# EAGLE board PowerSTEP01x4_002 (EAGLE 9.5.0), part 1 of 2
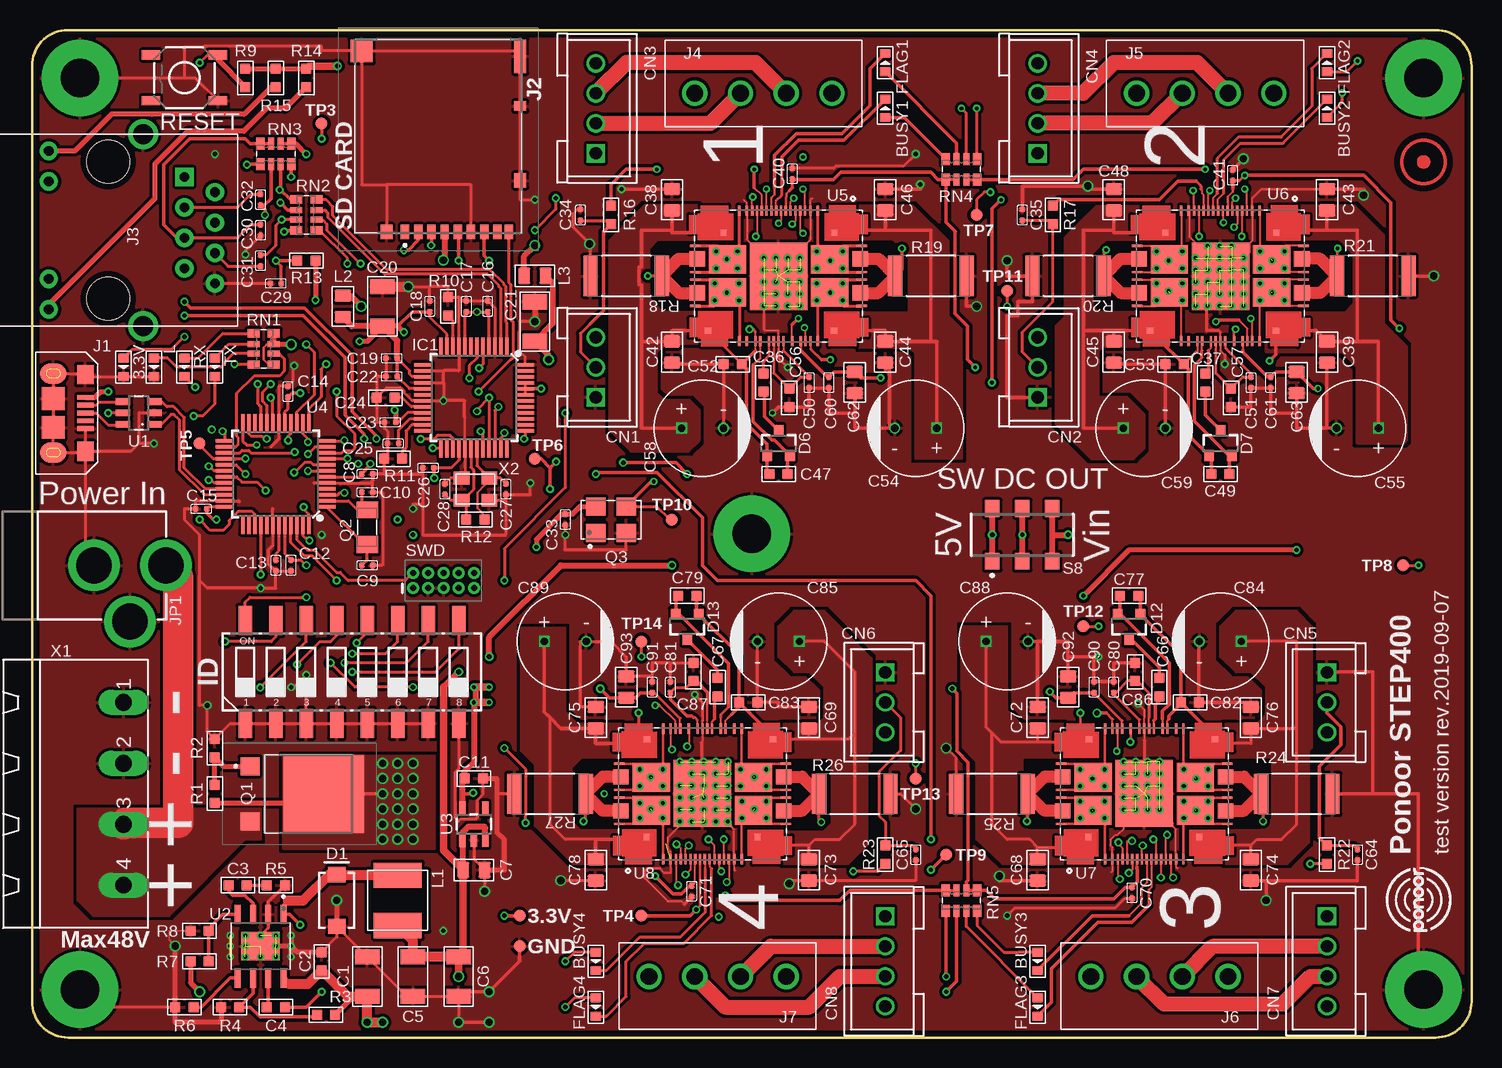
[diagram p3: board, top side]
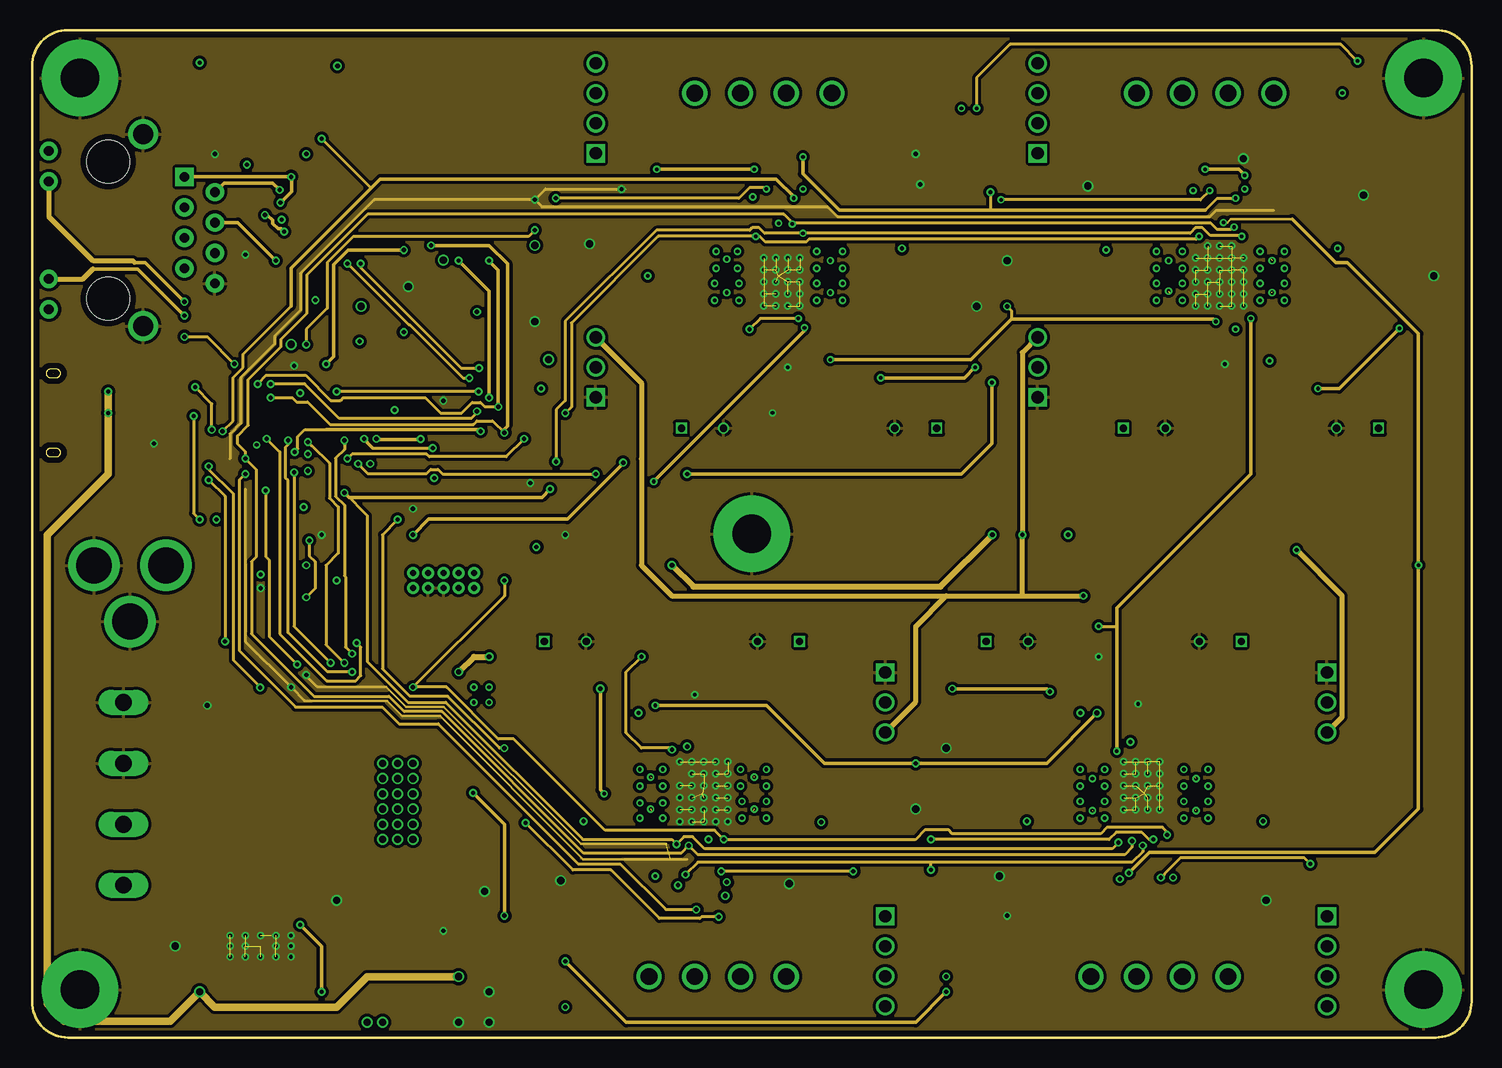
[diagram p4: board, inner layer Route2]
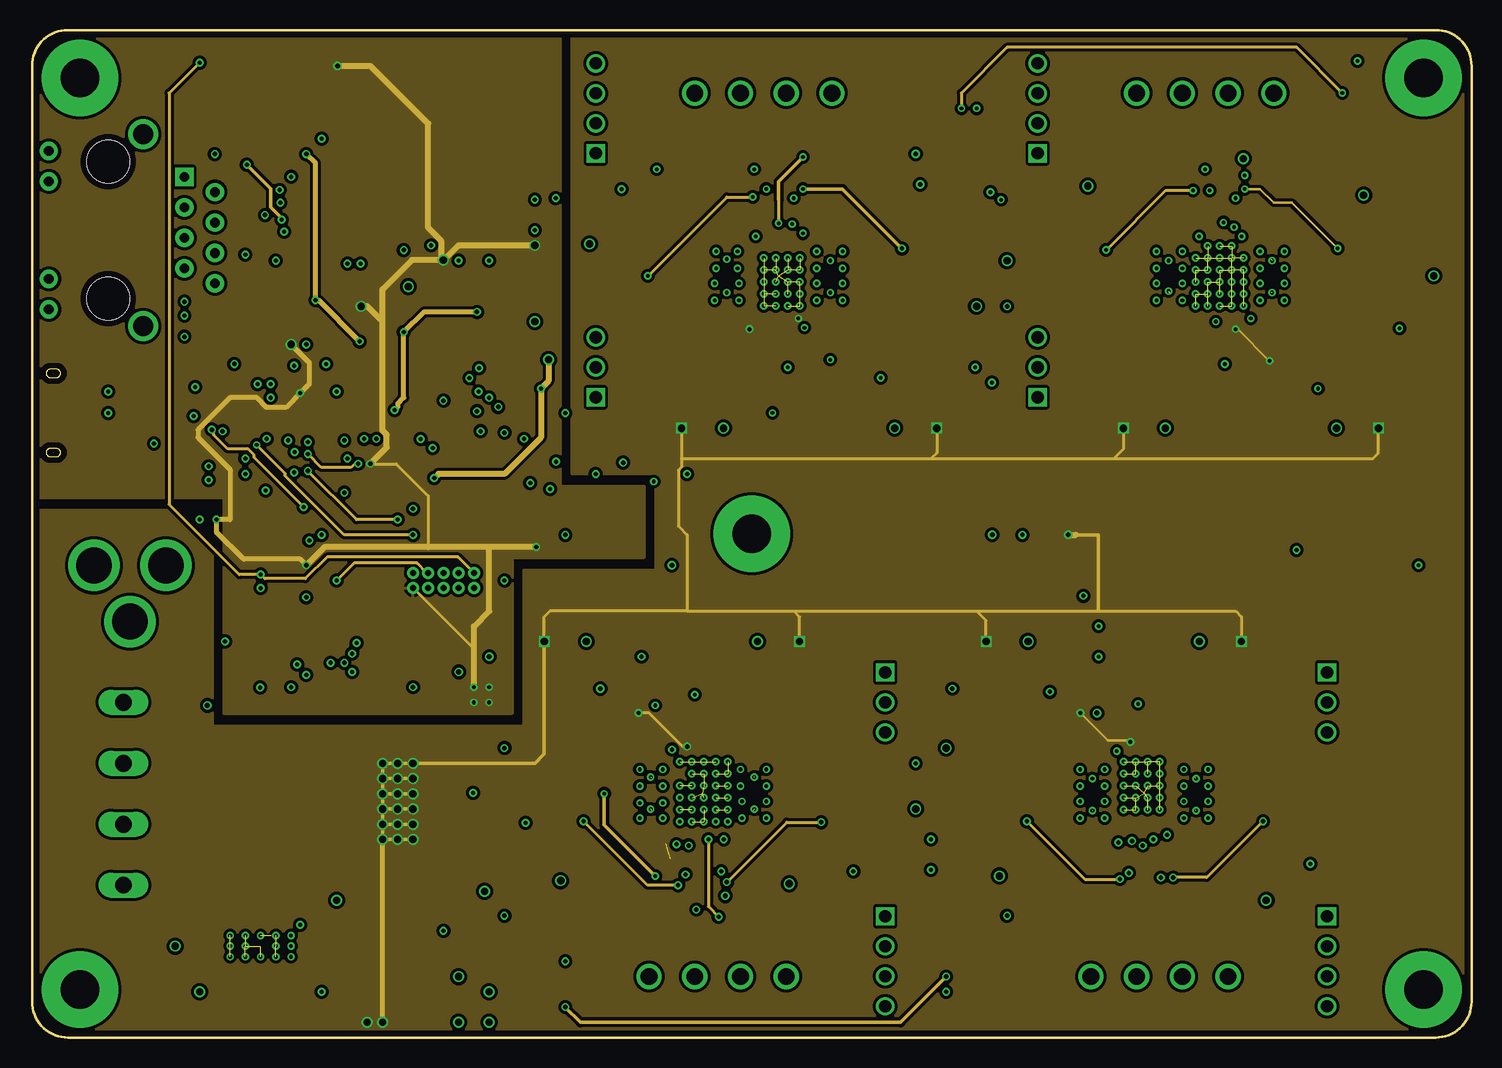
[diagram p5: board, inner layer Route15]
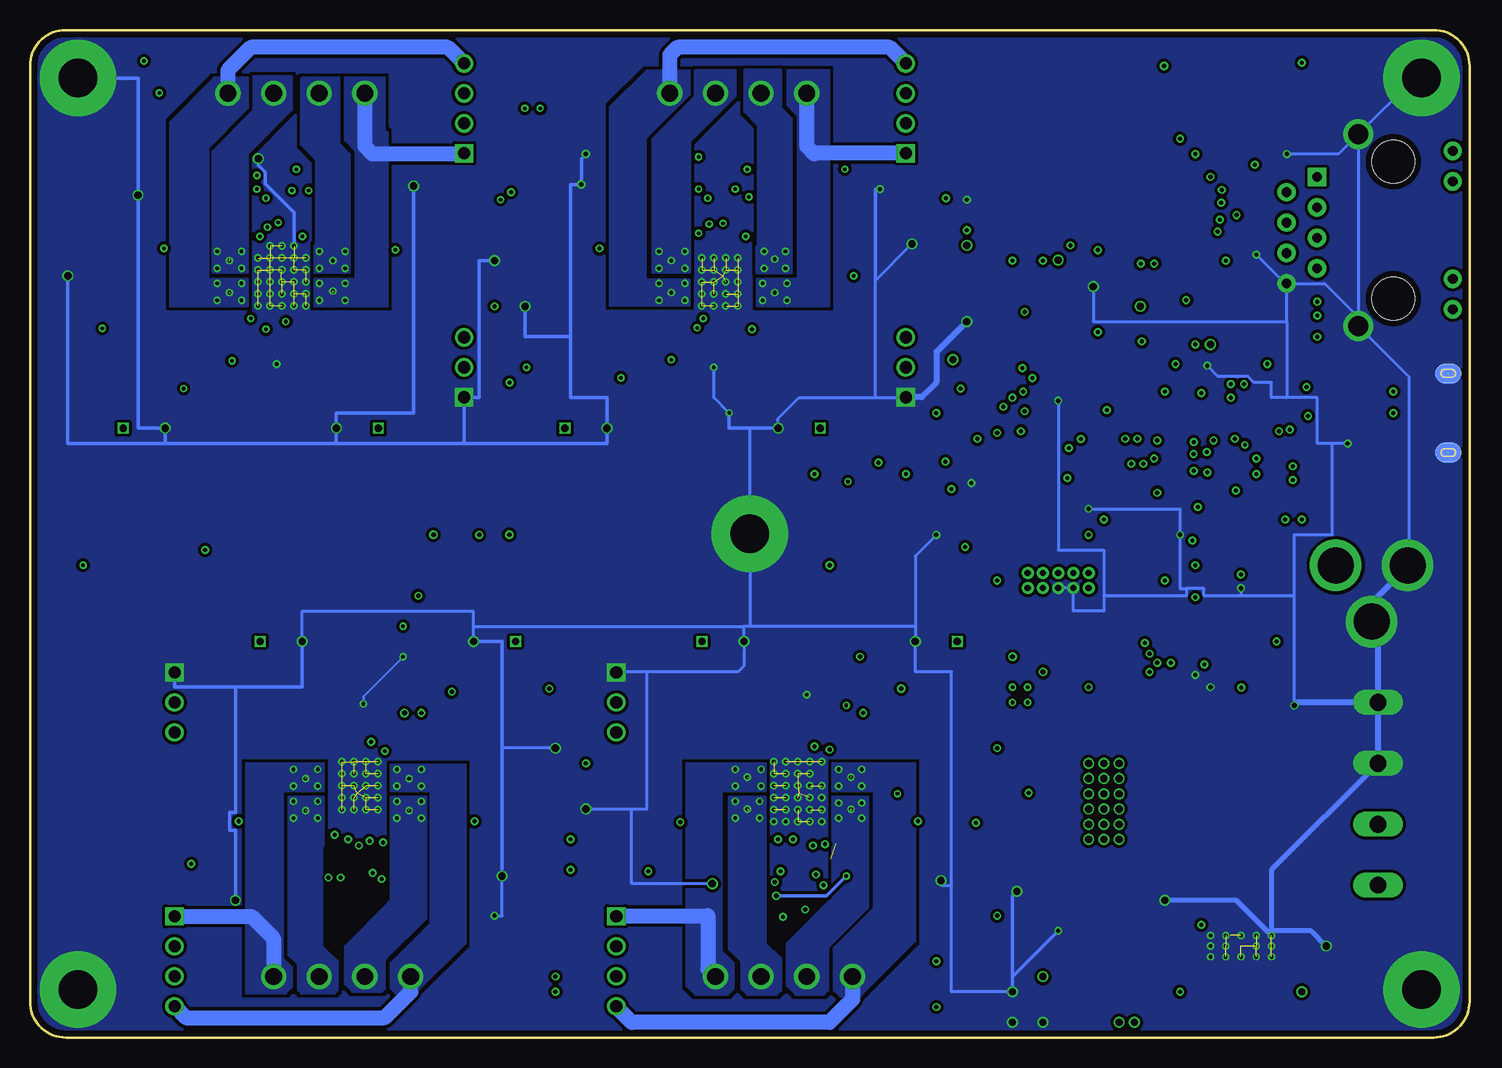
[diagram p6: board, bottom side, seen from below]

Size 120 x 84 mm. Coordinates in mm from the lower left corner, seen from the top.
Outline: 3,84 117,84 arc-90 120,81 120,3 arc-90 117,0 3,0 arc-90 0,3 0,81 arc-90 3,84
Copper layers (1+2*15+16): Top 0.035mm / dielectric 1.6mm / Route2 0.035mm / dielectric 1.2mm / Route15 0.035mm / dielectric 0.2mm / Bottom 0.035mm
Design rules "PcbGoGo_4-layer_PCB_eagle_rule *": minimum track width 6mil, minimum drill 12mil, track to track 6mil, track to pad 6mil, pad to pad 6mil, via to via 8mil, smd to smd 0mil, copper to edge 20mil, drill to drill 10mil, minimum pad ring 6mil, minimum via ring 6mil, stop-mask expansion 2mil, vias tented up to drill 100mil, thermal gap 10mil
tRestrict: area 27.9,8.9 to 33,14
vRestrict: area 27.9,8.9 to 33,14

## Footprints (pad centres in the part's own frame; a part is rotated, then mirrored left to right if it is on the bottom)
LED-0603 = smd 0.762 x 0.889: + -0.762,0; - 0.762,0
C1206 = smd 1.27 x 2.032: 1 -1.651,0; 2 1.651,0
C0603 = smd 0.889 x 0.889: 1 0,0.762; 2 0,-0.762
C0805 = smd 1.397 x 1.016: 1 0,0.889; 2 0,-0.889
C0402 = smd 0.5 x 0.5: 1 0,0.463; 2 0,-0.463
C_POL_D8 = drill 0.6 square: + -1.75,0 | drill 0.6: - 1.75,0
B3B-XASK-1 = drill 1.016 square: 1 -2.5,0 | drill 1.016: 2 0,0; 3 2.5,0
B4B-XASK-1 = drill 1.016 square: 1 -3.75,0 | drill 1.016: 2 -1.25,0; 3 1.25,0; 4 3.75,0
SMA-DIODE = smd 1.27 x 1.47: A -2.15,0; C 2.15,0
SOT23-3 = smd 0.8 x 0.9: 1 -0.95,-1; 2 0.95,-1; 3 0,1.1
TQFP48-LONG = smd 1.5 x 0.28: 1 -4.25,2.75; 2 -4.25,2.25; 3 -4.25,1.75; 4 -4.25,1.25; 5 -4.25,0.75; 6 -4.25,0.25; 7 -4.25,-0.25; 8 -4.25,-0.75; 9 -4.25,-1.25; 10 -4.25,-1.75; 11 -4.25,-2.25; 12 -4.25,-2.75; 25 4.25,-2.75; 26 4.25,-2.25; 27 4.25,-1.75; 28 4.25,-1.25; 29 4.25,-0.75; 30 4.25,-0.25; 31 4.25,0.25; 32 4.25,0.75; 33 4.25,1.25; 34 4.25,1.75; 35 4.25,2.25; 36 4.25,2.75 | smd 0.28 x 1.5: 13 -2.75,-4.25; 14 -2.25,-4.25; 15 -1.75,-4.25; 16 -1.25,-4.25; 17 -0.75,-4.25; 18 -0.25,-4.25; 19 0.25,-4.25; 20 0.75,-4.25; 21 1.25,-4.25; 22 1.75,-4.25; 23 2.25,-4.25; 24 2.75,-4.25; 37 2.75,4.25; 38 2.25,4.25; 39 1.75,4.25; 40 1.25,4.25; 41 0.75,4.25; 42 0.25,4.25; 43 -0.25,4.25; 44 -0.75,4.25; 45 -1.25,4.25; 46 -1.75,4.25; 47 -2.25,4.25; 48 -2.75,4.25
CTS-219-08 = smd 1.13 x 2.44: 1 -8.89,-4.3; 2 -6.35,-4.3; 3 -3.81,-4.3; 4 -1.27,-4.3; 5 1.27,-4.3; 6 3.81,-4.3; 7 6.35,-4.3; 8 8.89,-4.3; 9 8.89,4.3; 10 6.35,4.3; 11 3.81,4.3; 12 1.27,4.3; 13 -1.27,4.3; 14 -3.81,4.3; 15 -6.35,4.3; 16 -8.89,4.3
MICROUSB-FCI-PBAN = smd 0.4 x 1.35: 1 -1.3,1.27; 2 -0.65,1.27; 3 0,1.27; 4 0.65,1.27; 5 1.3,1.27 | smd 1.7 x 2.2: S1 -3.3,-1.4; S2 3.3,-1.4 | smd 1.6 x 1.4: S3 -3.2,1.27; S4 3.2,1.27 | smd 1.9 x 1.9: S5 -1.2,-1.405; S6 1.2,-1.405 | smd 1.7 x 2.2 bottom: S7 -3.3,-1.4; S8 3.3,-1.4
DM3ATSFPEJM542 = smd 0.7 x 1.2: 1 3.2,-0.1; 2 2.1,-0.1; 3 1,-0.1; 4 -0.1,-0.1; 5 -1.2,-0.1; 6 -2.3,-0.1; 7 -3.4,-0.1; 8 -4.5,-0.1; 9 -5.45,-0.1 | smd 1 x 1.2: 10 4.75,-0.1; 14 -6.4,-4.4 | smd 1.85 x 1.9: 11 6.825,-15.2 | smd 1 x 2.8: 12 -6.4,-14.75 | smd 1 x 0.8: 13 -6.4,-10.6
RJ45 = drill 0.813 pad 1.524: G+ 4.953,-6.604; G- 4.953,-4.064; GND -8.89,4.445; NC -6.35,3.175; P4 -8.89,-0.635; P5 -6.35,0.635; RD+ -6.35,-1.905; RD- -8.89,1.905; TD- -8.89,-3.175; Y+ 4.953,6.604; Y- 4.953,4.064 | drill 1.651 pad 2.159: SHIELD0 -2.921,8.001; SHIELD1 -2.921,-8.001 | drill 0.813 pad 1.524 square: TD+ -6.35,-4.445 | hole 3.556: 0,-5.715; 0,5.715
691321300004 = drill 1.4: 1 -5.715,0; 2 -1.905,0; 3 1.905,0; 4 5.715,0
POWER_JACK_PTH = drill 2.997 pad 4.318: GND 0,7.7; GNDBREAK 4.7,10.7; PWR 0,13.7
L5045_L = smd 2.1 x 4: P$1 -2.1,0; P$2 2.1,0
L0805 = smd 1.016 x 1.397: 1 -0.889,0; 2 0.889,0
ATP112TLH = smd 1.5 x 1.6: 1 -2.3,-8.5; 3 2.3,-8.5 | smd 6.5 x 6.7: 2 0,-2.35
FC-135 = smd 1.4 x 1.8: P$1 -1.45,0; P$2 1.45,0
SG5032 = smd 1.5 x 1.6: 1 -1.1,1.27; 2 -1.1,-1.27; 3 1.1,-1.27; 4 1.1,1.27
R0603 = smd 0.889 x 0.889: 1 0,0.762; 2 0,-0.762
RESC6332X71N = smd 1.194 x 3.353: 1 -2.972,0; 2 2.972,0
TACTILE-SWITCH-SMD = smd 1.524 x 0.762: 1 -2.794,1.905; 2 2.794,1.905; 3 -2.794,-1.905; 4 2.794,-1.905
CAY16_LONG_W = smd 0.7 x 1: 1 -1.3,-0.85; 4 1.3,-0.85; 5 1.3,0.85; 8 -1.3,0.85 | smd 0.5 x 1: 2 -0.4,-0.85; 3 0.4,-0.85; 6 0.4,0.85; 7 -0.4,0.85
STANDOFF-ELECTRICAL = drill 3.2 pad 6.35: P1 0,0
SSSS213202 = smd 1.2 x 1.4: 1 -2.5,-2.2; 2 0,-2.2; 3 2.5,-2.2; 4 -2.5,2.2; 5 0,2.2; 6 2.5,2.2
2X5-PTH-1.27MM = drill 0.508 pad 1: 1 -2.54,-0.635; 2 -2.54,0.635; 3 -1.27,-0.635; 4 -1.27,0.635; 5 0,-0.635; 6 0,0.635; 7 1.27,-0.635; 8 1.27,0.635; 9 2.54,-0.635; 10 2.54,0.635
PAD.03X.04 = smd 1.016 x 1.016: P$1 0,0
SOT23-6L = smd 0.55 x 1.2: 1 -0.95,-1.3; 2 0,-1.3; 3 0.95,-1.3; 4 0.95,1.3; 5 0,1.3; 6 -0.95,1.3
SOIC127P600X100-9N = smd 1.61 x 0.58: 1 -2.655,1.905; 2 -2.655,0.635; 3 -2.655,-0.635; 4 -2.655,-1.905; 5 2.655,-1.905; 6 2.655,-0.635; 7 2.655,0.635; 8 2.655,1.905 | smd 2.4 x 3.2: 9 0,0
SOT23-5 = smd 0.55 x 1.2: 1 -0.95,-1.3; 2 0,-1.3; 3 0.95,-1.3; 4 0.95,1.3; 5 -0.95,1.3
TQFP-48 = smd 1.5 x 0.28: 1 -4.25,2.75; 2 -4.25,2.25; 3 -4.25,1.75; 4 -4.25,1.25; 5 -4.25,0.75; 6 -4.25,0.25; 7 -4.25,-0.25; 8 -4.25,-0.75; 9 -4.25,-1.25; 10 -4.25,-1.75; 11 -4.25,-2.25; 12 -4.25,-2.75; 25 4.25,-2.75; 26 4.25,-2.25; 27 4.25,-1.75; 28 4.25,-1.25; 29 4.25,-0.75; 30 4.25,-0.25; 31 4.25,0.25; 32 4.25,0.75; 33 4.25,1.25; 34 4.25,1.75; 35 4.25,2.25; 36 4.25,2.75 | smd 0.28 x 1.5: 13 -2.75,-4.25; 14 -2.25,-4.25; 15 -1.75,-4.25; 16 -1.25,-4.25; 17 -0.75,-4.25; 18 -0.25,-4.25; 19 0.25,-4.25; 20 0.75,-4.25; 21 1.25,-4.25; 22 1.75,-4.25; 23 2.25,-4.25; 24 2.75,-4.25; 37 2.75,4.25; 38 2.25,4.25; 39 1.75,4.25; 40 1.25,4.25; 41 0.75,4.25; 42 0.25,4.25; 43 -0.25,4.25; 44 -0.75,4.25; 45 -1.25,4.25; 46 -1.75,4.25; 47 -2.25,4.25; 48 -2.75,4.25
IC_POWERSTEP01 = smd 0.5 x 0.5: 1 -3.6,4.65; 23 -3.6,-4.6; 43 4.55,-5.9; 66 4.55,4.6 | smd 0.86 x 0.19: 7 -5.435,3.27; 8 -5.435,2.65; 9 -5.435,2.2; 10 -5.435,1.8; 11 -5.435,1.4; 12 -5.435,1; 13 -5.435,0.6; 14 -5.435,0.2; 15 -5.435,-0.2; 16 -5.435,-0.6; 17 -5.435,-1; 18 -5.435,-1.4; 19 -5.435,-1.8; 20 -5.435,-2.2; 21 -5.435,-2.65; 22 -5.435,-3.27; 53 5.435,-3.27; 54 5.435,-2.65; 55 5.435,-1.93; 56 5.435,-1.53; 57 5.435,-0.8; 58 5.435,-0.4; 59 5.435,0; 60 5.435,0.4; 61 5.435,1.13; 62 5.435,1.85; 63 5.435,2.25; 64 5.435,2.65; 65 5.435,3.27 | smd 0.19 x 0.86: 33 -2.51,-6.935; 37 -0.32,-6.935; 38 0.32,-6.935; 42 2.51,-6.935; 76 2.51,6.935; 80 0.32,6.935; 81 -0.32,6.935; 85 -2.51,6.935 | smd 1.26 x 1.3: 34 -1.42,-6.79; 39 1.42,-6.79; 77 1.42,6.79; 82 -1.42,6.79 | smd 2.4 x 3.1: EPAD3 -1.38,-4.26; EPAD4 1.38,-4.26; EPAD7 1.38,4.26; EPAD8 -1.38,4.27 | smd 5.6 x 4.8: EPAD9 0.04,0
MSTBA4 = drill 1.397 long: 1 -7.62,5.08; 2 -2.54,5.08; 3 2.54,5.08; 4 7.62,5.08
CRYSTAL-3.2-2.5 = smd 1.3 x 1.05: 1 -1.15,-0.925; 2 1.15,-0.925; 3 1.15,0.925; 4 -1.15,0.925

## Placement (x,y rotation side)
3.3V  GREEN-0603  [LED-0603]  7.62,55.88 270 top
BUSY1  GREEN-0603  [LED-0603]  71.12,77.47 90 top
BUSY2  GREEN-0603  [LED-0603]  107.95,77.47 90 top
BUSY3  GREEN-0603  [LED-0603]  83.82,6.35 270 top
BUSY4  GREEN-0603  [LED-0603]  46.99,6.35 270 top
C1  10uf  [C1206]  27.94,5.08 270 top
C2  100nf  [C0603]  24.13,6.35 0 top
C3  100nf  [C0603]  17.14,12.7 270 top
C4  100nf  [C0603]  20.32,2.54 90 top
C5  47uF  [C1206]  31.75,5.08 90 top
C6  47uF  [C1206]  35.56,5.08 90 top
C7  10uf  [C0805]  36.83,13.97 270 top
C8  100nf  [C0402]  27.94,46.99 90 top
C9  12pF  [C0402]  27.94,39.37 270 top
C10  12pF  [C0402]  27.94,45.47 90 top
C11  4.7uf  [C0603]  36.83,21.59 270 top
C12  100nf  [C0402]  21.59,39.37 0 top
C13  100nf  [C0402]  20.32,39.37 0 top
C14  100nf  [C0402]  21.34,53.85 180 top
C15  100nf  [C0402]  14.1,44.07 270 top
C16  100nf  [C0402]  37.97,60.96 180 top
C17  100nf  [C0402]  36.2,60.96 180 top
C18  100nf  [C0402]  33.15,60.96 180 top
C19  100nf  [C0402]  29.97,56.64 270 top
C20  47uF  [C1206]  29.21,60.96 90 top
C21  47uF  [C1206]  41.91,59.69 90 top
C22  100nf  [C0402]  29.97,55.12 270 top
C23  100nf  [C0402]  29.84,51.31 270 top
C24  4.7uf  [C0603]  29.46,53.34 90 top
C25  10nf  [C0402]  30.1,49.53 90 top
C26  100nf  [C0402]  33.02,47.5 90 top
C27  22pF  [C0402]  39.5,45.72 0 top
C28  22pF  [C0402]  34.42,45.72 180 top
C29  22NF 50V  [C0402]  20.32,62.87 270 top
C30  10nf  [C0402]  19.05,67.31 0 top
C31  6.8nF  [C0402]  19.05,64.77 0 top
C32  6.8nF  [C0402]  19.05,69.85 180 top
C33  100nf  [C0402]  44.45,43.18 180 top
C34  10nf  [C0402]  45.72,68.58 0 top
C35  10nf  [C0402]  82.55,68.58 0 top
C36  47nF  [C0603]  60.96,54.61 0 top
C37  47nF  [C0603]  97.79,54.61 0 top
C38  220nF  [C0805]  53.34,69.85 0 top
C39  220nF  [C0805]  107.95,57.15 180 top
C40  100nf  [C0402]  63.37,72.01 180 top
C41  100nf  [C0402]  100.08,71.88 180 top
C42  220nF  [C0805]  53.34,57.15 180 top
C43  220nF  [C0805]  107.95,69.85 0 top
C44  220nF  [C0805]  71.12,57.15 180 top
C45  220nF  [C0805]  90.17,57.15 180 top
C46  220nF  [C0805]  71.12,69.85 0 top
C47  470nF  [C0603]  62.23,46.99 270 top
C48  220nF  [C0805]  90.17,69.85 0 top
C49  470nF  [C0603]  99.06,46.99 270 top
C50  100nf  [C0402]  64.77,54.61 0 top
C51  100nf  [C0402]  101.6,54.61 0 top
C52  100nf  [C0603]  58.42,56.13 90 top
C53  100nf  [C0603]  95.25,56.13 90 top
C54  100uF  [C_POL_D8]  73.66,50.8 180 top
C55  100uF  [C_POL_D8]  110.49,50.8 180 top
C56  470nF  [C0603]  63.12,53.34 180 top
C57  470nF  [C0603]  99.95,53.34 180 top
C58  100uF  [C_POL_D8]  55.88,50.8 0 top
C59  100uF  [C_POL_D8]  92.71,50.8 0 top
C60  220nF  [C0402]  66.42,54.61 180 top
C61  220nF  [C0402]  103.25,54.61 180 top
C62  22uf  [C0805]  68.58,54.61 180 top
C63  22uf  [C0805]  105.41,54.61 180 top
C64  10nf  [C0402]  110.49,15.24 180 top
C65  10nf  [C0402]  73.66,15.24 180 top
C66  47nF  [C0603]  93.98,29.21 180 top
C67  47nF  [C0603]  57.15,29.21 180 top
C68  220nF  [C0805]  83.82,13.97 180 top
C69  220nF  [C0805]  64.77,26.67 0 top
C70  100nf  [C0402]  91.69,12.06 0 top
C71  100nf  [C0402]  54.99,12.19 0 top
C72  220nF  [C0805]  83.82,26.67 0 top
C73  220nF  [C0805]  64.77,13.97 180 top
C74  220nF  [C0805]  101.6,13.97 180 top
C75  220nF  [C0805]  46.99,26.67 0 top
C76  220nF  [C0805]  101.6,26.67 0 top
C77  470nF  [C0603]  91.44,36.83 90 top
C78  220nF  [C0805]  46.99,13.97 180 top
C79  470nF  [C0603]  54.61,36.83 90 top
C80  100nf  [C0402]  90.17,29.21 180 top
C81  100nf  [C0402]  53.21,29.21 180 top
C82  100nf  [C0603]  96.52,27.94 270 top
C83  100nf  [C0603]  59.69,27.94 270 top
C84  100uF  [C_POL_D8]  99.06,33.02 180 top
C85  100uF  [C_POL_D8]  62.23,33.02 180 top
C86  470nF  [C0603]  91.95,30.48 0 top
C87  470nF  [C0603]  55.12,30.48 0 top
C88  100uF  [C_POL_D8]  81.28,33.02 0 top
C89  100uF  [C_POL_D8]  44.45,33.02 0 top
C90  220nF  [C0402]  88.52,29.21 0 top
C91  220nF  [C0402]  51.69,29.21 0 top
C92  22uf  [C0805]  86.36,29.21 0 top
C93  22uf  [C0805]  49.53,29.21 0 top
CN1  [B3B-XASK-1]  46.99,55.88 90 top
CN2  [B3B-XASK-1]  83.82,55.88 90 top
CN3  [B4B-XASK-1]  46.99,77.47 90 top
CN4  [B4B-XASK-1]  83.82,77.47 90 top
CN5  [B3B-XASK-1]  107.95,27.94 270 top
CN6  [B3B-XASK-1]  71.12,27.94 270 top
CN7  [B4B-XASK-1]  107.95,6.35 270 top
CN8  [B4B-XASK-1]  71.12,6.35 270 top
D1  3A/40V/500mV  [SMA-DIODE]  25.4,11.43 90 top
D6  BAR43  [SOT23-3]  62.23,49.53 0 top
D7  BAR43  [SOT23-3]  99.06,49.53 0 top
D12  BAR43  [SOT23-3]  91.44,34.29 180 top
D13  BAR43  [SOT23-3]  54.61,34.29 180 top
FLAG1  YELLOW-0603  [LED-0603]  71.12,81.28 90 top
FLAG2  YELLOW-0603  [LED-0603]  107.95,81.28 90 top
FLAG3  YELLOW-0603  [LED-0603]  83.82,2.54 270 top
FLAG4  YELLOW-0603  [LED-0603]  46.99,2.54 270 top
IC1  0982_W5500LONG  [TQFP48-LONG]  36.83,53.34 270 top
ID  219-08  [CTS-219-08]  26.67,30.48 0 top
J1  [MICROUSB-FCI-PBAN]  3.17,52.07 270 top
J2  DM3AT-SF-PEJM5(42)  [DM3ATSFPEJM542]  34.29,67.06 180 top
J3  [RJ45]  6.35,67.31 180 top
J4  691321300004  [691321300004]  60.96,78.74 0 top
J5  691321300004  [691321300004]  97.79,78.74 0 top
J6  691321300004  [691321300004]  93.98,5.08 180 top
J7  691321300004  [691321300004]  57.15,5.08 180 top
JP1  POWER_JACKPTH  [POWER_JACK_PTH]  -2.54,39.37 270 top
L  BLUE-0603  [LED-0603]  10.16,55.88 270 top
L1  150uH  [L5045_L]  30.48,11.43 270 top
L2  330R-1500MA  [L0805]  25.91,60.96 270 top
L3  330R-1500MA  [L0805]  41.91,63.5 0 top
Q1  ATP112-TL-H  [ATP112TLH]  26.67,20.32 270 top
Q2  32.768kHz  [FC-135]  27.94,42.55 270 top
Q3  [SG5032]  48.26,43.18 90 top
R1  150k  [R0603]  15.24,20.32 0 top
R2  100k  [R0603]  15.24,24.13 0 top
R3  110k  [R0603]  24.51,1.91 90 top
R4  33k  [R0603]  16.51,2.54 90 top
R5  4.7k  [R0603]  20.32,12.7 270 top
R6  13k  [R0603]  12.7,2.54 90 top
R7  3k  [R0603]  13.97,6.35 270 top
R8  750  [R0603]  13.97,8.89 90 top
R9  10K 1/10W  [R0603]  17.78,80.01 180 top
R10  12.4K  [R0603]  34.67,60.96 0 top
R11  10K 1/10W  [R0603]  30.1,48.26 90 top
R12  1M 1/10W  [R0603]  36.96,43.18 270 top
R13  10R  [R0603]  22.86,64.77 90 top
R14  330R  [R0603]  22.86,80.01 180 top
R15  330R  [R0603]  20.32,80.01 180 top
R16  100R  [R0603]  48.26,68.58 180 top
R17  100R  [R0603]  85.09,68.58 180 top
R18  0.1  [RESC6332X71N]  49.53,63.5 180 top
R19  0.1  [RESC6332X71N]  74.93,63.5 0 top
R20  0.1  [RESC6332X71N]  86.36,63.5 180 top
R21  0.1  [RESC6332X71N]  111.76,63.5 0 top
R22  100R  [R0603]  107.95,15.24 0 top
R23  100R  [R0603]  71.12,15.24 0 top
R24  0.1  [RESC6332X71N]  105.41,20.32 0 top
R25  0.1  [RESC6332X71N]  80.01,20.32 180 top
R26  0.1  [RESC6332X71N]  68.58,20.32 0 top
R27  0.1  [RESC6332X71N]  43.18,20.32 180 top
RESET  RESET  [TACTILE-SWITCH-SMD]  12.7,80.01 180 top
RN1  330  [CAY16_LONG_W]  19.3,57.4 270 top
RN2  33  [CAY16_LONG_W]  22.86,68.58 270 top
RN3  49.9  [CAY16_LONG_W]  20.32,73.66 180 top
RN4  330  [CAY16_LONG_W]  77.47,72.39 0 top
RN5  330  [CAY16_LONG_W]  77.47,11.43 180 top
RX  RED-0603  [LED-0603]  12.7,55.88 270 top
S3  STANDOFF_ELECTRICAL  [STANDOFF-ELECTRICAL]  60,42 0 top
S4  STANDOFF_ELECTRICAL  [STANDOFF-ELECTRICAL]  116,80 0 top
S5  STANDOFF_ELECTRICAL  [STANDOFF-ELECTRICAL]  116,4 0 top
S6  STANDOFF_ELECTRICAL  [STANDOFF-ELECTRICAL]  4,80 0 top
S7  STANDOFF_ELECTRICAL  [STANDOFF-ELECTRICAL]  4,4 0 top
S8  SSSS213202  [SSSS213202]  82.55,41.91 0 top
SWD  CORTEX_DEBUGPTH  [2X5-PTH-1.27MM]  34.29,38.1 0 top
TP1  TEST-POINT3X4  [PAD.03X.04]  40.64,10.16 0 top
TP2  TEST-POINT3X4  [PAD.03X.04]  40.64,7.62 0 top
TP3  TEST-POINT3X4  [PAD.03X.04]  24.13,76.2 0 top
TP4  TEST-POINT3X4  [PAD.03X.04]  50.8,10.16 0 top
TP5  TEST-POINT3X4  [PAD.03X.04]  13.97,49.53 0 top
TP6  TEST-POINT3X4  [PAD.03X.04]  41.91,48.26 0 top
TP7  TEST-POINT3X4  [PAD.03X.04]  78.74,68.58 0 top
TP8  TEST-POINT3X4  [PAD.03X.04]  114.3,39.37 0 top
TP9  TEST-POINT3X4  [PAD.03X.04]  76.2,15.24 0 top
TP10  TEST-POINT3X4  [PAD.03X.04]  53.34,43.18 0 top
TP11  TEST-POINT3X4  [PAD.03X.04]  81.28,62.23 0 top
TP12  TEST-POINT3X4  [PAD.03X.04]  87.63,34.29 0 top
TP13  TEST-POINT3X4  [PAD.03X.04]  73.66,21.59 0 top
TP14  TEST-POINT3X4  [PAD.03X.04]  50.8,33.02 0 top
TX  YELLOW-0603  [LED-0603]  15.24,55.88 270 top
U1  USBLC6-2SC6  [SOT23-6L]  8.89,52.07 90 top
U2  BD9G341AEFJ  [SOIC127P600X100-9N]  19.05,7.62 270 top
U3  3.3V  [SOT23-5]  36.83,17.78 0 top
U4  ATSAMD21G-A  [TQFP-48]  20.32,46.99 180 top
U5  POWERSTEP01  [IC_POWERSTEP01]  62.23,63.5 270 top
U6  POWERSTEP01  [IC_POWERSTEP01]  99.06,63.5 270 top
U7  POWERSTEP01  [IC_POWERSTEP01]  92.71,20.32 90 top
U8  POWERSTEP01  [IC_POWERSTEP01]  55.88,20.32 90 top
U$1  [FIDUCIAL_MARKER_PBAN]  116,73 0 top
U$3  [PONOOR_LOGO_6MM]  115.57,11.43 90 top
X1  MSTBA4  [MSTBA4]  2.54,20.32 270 top
X2  25MHz  [CRYSTAL-3.2-2.5]  36.96,45.72 0 top

## Tracks (layer width: path | path; a pad name or v marks a point on that pad's centre or on a via)
1V2O
  Top 0.254: C25.2 30.56,50.63 31.52,51.59 IC1.22
3.3V  (via drill 0.3 pad 0.3, 0.35, 0.4 pad 0.3, 0.6)
  Top 0.203: RN1.7 20.14,57.78 19.56,57.78 19.3,57.53 19.3,56.52 19.71,56.1 RN1.5
  Top 0.254: U4.44 21.07,40.35 C12.1 22.4,39.83 v22.86,39.37 | U4.36 14.73,44.24 C15.1 | U4.17 21.07,52.14 21.34,52.4 C14.1 | U4.6 27.23,46.74 C8.1
  Top 0.305: v22.35,53.72 21.67,53.72 C14.1 | C15.1 14.56,43.73 15.11,43.18 v15.37,43.18 | v28.19,47.83 28.19,47.71 28.11,47.62 28.07,47.62 27.77,47.33 27.77,47.28 C8.1 | TP1.P$1 v39.37,10.16 | v36.75,20.4 36.68,20.32 35.88,20.32
  Top 0.406: RN1.8 RN1.7 21.57,57.8 v21.59,57.78 | R9.2 R15.2 R14.2 | Q3.4 45.68,44.28 45.04,43.64 C33.2 44.15,43.64 42.04,41.53 v42.04,40.89
  Top 0.508: U3.5 35.88,20.32 35.88,21.4 C11.2 36.07,22.23 36.83,22.99 v36.83,27.94 36.96,28.07 36.96,29.08 v36.83,29.21 | J2.4 34.39,64.91 v34.29,64.81 | L3.1 41.02,65.15 v41.91,66.04 | v27.43,60.96 26.54,61.85 L2.1
  Top 0.61: v38.1,27.94 v36.83,27.94 | v38.1,29.21 v36.83,29.21 | R14.2 23.09,81 v25.46,81
  Route2 0.305: v39.37,10.16 39.37,17.78 v36.75,20.4
  Route15 0.254: SWD.1 36.83,32.38 v36.83,29.21 | v28.19,47.83 30.35,47.83 33.02,45.17 33.02,40.89
  Route15 0.406: v22.86,39.37 22.35,39.88 17.65,39.88 15.37,42.16 v15.37,43.18 16.51,43.18 16.51,47.37 13.84,50.04 13.84,50.67 16.51,53.34 18.75,53.34 19.55,52.53 21.16,52.53 v22.35,53.72 23.11,54.48 23.11,56.26 v21.59,57.78
  Route15 0.508: v42.04,40.89 38.1,40.89 | 38.1,40.89 33.02,40.89 24.38,40.89 v22.86,39.37 | v34.29,64.81 34.13,64.97 34.13,66.39 33.02,67.51 33.02,76.2 28.22,81 v25.46,81 | v34.29,64.81 35.52,66.04 v41.91,66.04 | v36.83,29.21 36.83,34.29 38.1,35.56 38.1,40.89 | 29.21,59.69 29.21,50.62 29.56,50.27 29.56,49.2 v28.19,47.83 | 29.21,59.69 29.21,62.36 31.67,64.81 v34.29,64.81 | 29.21,59.69 27.94,60.96 v27.43,60.96
  pour Route15 (isolate 0.254, rank 6): 0,84 44,84 44,46 51,46 51,40 40,40 40,27 16,27 16,45 0,45
5V  (via drill 0.35, 0.4, 0.6)
  Top 0.254: U1.5 v6.35,52.07
  Top 0.406: R7.2 13.21,4.57 v13.97,3.81 | J1.1 5.24,53.37 5.71,53.85 v6.35,53.85
  Top 0.508: S8.1 v80.05,41.91 S8.4 | C7.2 35.88,14.03 U3.1 35.88,17.09 36.35,17.56 37.68,17.56 37.78,17.46 U3.3 | 34.29,29.21 v35.56,30.48 | v38.1,31.75 38.1,33.39 44.08,39.37 v53.34,39.37
  Top 0.61: 34.29,29.21 34.29,15.62 C7.2 35.94,7.11 C6.2 v35.56,5.08
  Top 0.813: C6.2 C5.2 31.75,8.06 L1.P$2
  Route2 0.508: v38.1,31.75 36.83,31.75 v35.56,30.48 | v53.34,39.37 55.12,37.59 75.73,37.59 v80.05,41.91
  Route2 0.61: v6.35,53.85 v6.35,52.07 6.35,46.99 1.27,41.91 1.27,2.79 2.7,1.37 11.53,1.37 v13.97,3.81 15.24,2.54 25.4,2.54 27.94,5.08 v35.56,5.08
!RESET  (via drill 0.35)
  Top 0.254: U4.40 19.07,41.84 19.05,41.83 v19.05,38.61 | v13.97,81.28 14.61,81.92 RESET.3
  Top 0.406: RESET.3 15.49,81.53 R9.1
  Route15 0.254: v13.97,81.28 11.43,78.74 11.43,44.45 17.28,38.6 v19.04,38.6 v19.05,38.61 19.4,38.26 22.78,38.26 24.58,40.05 35.51,40.05 SWD.10
+3V3A  (via drill 0.35)
  Top 0.254: IC1.4 38.08,60.39 C16.1 v37.08,60.5 C17.1 36.08,60.38 IC1.8 | IC1.11 34.58,58.64 33.15,60.07 C18.1 | IC1.21 31.3,52.09 30.52,51.31 C23.1 | IC1.17 31.46,54.09 C22.1 | C19.1 31.47,55.6 31.47,55.3 31.69,55.09 IC1.15
  Top 0.305: RN3.1 RN3.2 | C19.1 C22.1 | 30.48,59.31 31.67,60.5 C18.1
  Top 0.406: R13.2 v23.62,61.47 | v30.99,58.8 30.48,59.31 C20.1 27.94,58.04 v27.3,58.04 | v22.86,73.66 22.01,74.51 RN3.1 | v30.23,52.32 30.31,52.24 C23.1
  Top 0.508: L2.2 26.67,59.31 C20.1 30.43,58.08 C19.1
  Route15 0.406: v37.08,60.5 32.68,60.5 v30.99,58.8 30.99,53.34 30.48,52.83 30.48,52.58 v30.23,52.32 | v27.3,58.04 23.88,61.47 v23.62,61.47 23.62,72.9 v22.86,73.66
+3V3D  (via drill 0.35, 0.6)
  Top 0.254: IC1.28 35.58,48.15 34.92,47.5 C26.2 | IC1.45 IC1.44 IC1.43
  Top 0.305: v33.53,46.64 33.53,47.45 C26.2 | IC1.44 41.09,54.1 v42.42,54.1
  Top 0.508: L3.2 43.41,62.89 43.41,59.54 C21.1 43.05,56.9 v43.05,56.52
  Route15 0.508: v43.05,56.52 43.05,54.74 v42.42,54.1 42.42,50.04 39.37,46.99 33.88,46.99 v33.53,46.64
ACT  (via drill 0.35)
  Top 0.254: IC1.27 35.08,49.98 34.87,50.2 33.79,50.2 33.49,49.9 v32.38,49.9
  Top 0.305: v28.7,49.91 28.7,50.16 26.67,52.2 26.67,56.9 22.73,60.83 13.21,60.83 v12.7,61.34
  Route2 0.305: v32.38,49.9 32.32,49.84 28.78,49.84 v28.7,49.91 | v12.7,61.34 9.43,64.61 8.54,64.61
  Route2 0.406: J3.G- 1.4,68.45 5.11,64.74 8.41,64.74 8.54,64.61
D13
  Top 0.203: 17.07,50.13 17.18,50.03 17.18,49.53 17.18,49.45
  Top 0.254: 17.18,49.45 16.97,49.24 U4.26 | 20.59,57 20.79,56.81 20.8,56.81 21.01,56.6 21.01,55.55 20.62,55.16 18.51,55.16 17.07,53.72 17.07,50.13
  Top 0.305: RN1.6 20.59,57
D+
  Top 0.254: J1.3 5.33,52.07 6.35,51.05 7.52,51.05 U1.6
DIPSW1  (via drill 0.35)
  Top 0.254: v23.11,41.44 22.92,41.63 22.78,41.63 22.57,41.85 U4.47 | v22.86,36.7 18.16,36.7 17.78,36.32 ID.16
  Route2 0.254: v23.11,41.44 23.11,40.15 23.59,39.67 23.59,37.43 v22.86,36.7
DIPSW2  (via drill 0.35)
  Top 0.254: U4.32 15.17,46.24 14.94,46.48 v14.73,46.48 | ID.15 20.32,33.4 19.94,33.02 v16.08,33.02
  Route2 0.254: v14.73,46.48 16.08,45.13 v16.08,33.02
DIPSW3  (via drill 0.35)
  Top 0.254: U4.30 15.17,47.24 14.79,47.62 v14.73,47.62 | ID.14 22.86,33.02 v19.01,29.17
  Route2 0.254: v14.73,47.62 14.73,47.37 16.76,45.33 16.76,31.46 19.01,29.22 v19.01,29.17
DIPSW4  (via drill 0.35)
  Top 0.254: U4.31 17.07,46.74 17.5,46.31 18.76,46.31 v19.48,45.59 | v22.1,31.11 24,33.02 24.89,33.02 25.4,33.53 ID.13
  Route2 0.254: v22.1,31.11 19.78,33.43 19.78,39.8 19.48,40.1 v19.48,45.59
DIPSW5  (via drill 0.35)
  Top 0.254: v19.56,49.91 19.4,49.91 19.18,50.13 18.28,50.13 18.07,50.34 U4.23 | v27.05,32.89 27.94,33.78 ID.12
  Route2 0.254: v19.56,49.91 20.65,48.82 20.65,33.66 24.56,29.75 26.97,29.75 27.4,30.18 27.4,32.54 v27.05,32.89
DIPSW6  (via drill 0.35)
  Top 0.254: U4.12 25.99,49.74 v26.04,49.78 | ID.11 30.48,33.02 29.46,32 v26.67,32
  Route2 0.254: v26.04,49.78 26.04,49.04 25.3,48.31 25.3,45.12 26.04,44.39 26.04,38.5 26.13,38.4 26.13,32.54 v26.67,32
DIPSW7  (via drill 0.35)
  Top 0.254: U4.14 22.57,50.34 22.99,49.93 v22.99,49.66 | ID.10 33.02,33.02 31.24,31.24 v26.04,31.24
  Route2 0.254: v22.99,49.66 23.27,49.37 23.3,49.37 24.8,47.88 24.8,44.96 25.53,44.23 25.53,40.39 24.51,39.37 24.51,32.75 26.02,31.24 v26.04,31.24
DIPSW8  (via drill 0.35)
  Top 0.254: U4.16 21.57,50.34 21.34,50.11 v21.34,49.78 | v26.67,30.48 33.66,30.48 35.56,32.38 ID.9
  Route2 0.254: v21.34,49.78 21.34,49.42 21.16,49.24 21.16,46.64 21.34,46.46 21.34,33.76 24.62,30.48 v26.67,30.48
GND  (via drill 0.3, 0.3 pad 0.3, 0.35, 0.4 pad 0.3, 0.6)  (97 unrouted)
  Top 0.127: R8.1 11.43,8.89 11.43,8.13 v11.94,7.62
  Top 0.15: U8.59 55.88,26.38
  Top 0.152: v64,65 64,65.65 64.88,66.53 U5.8 64.88,69.83 65.02,69.98 | v61,65 61,65.11 59.58,66.53 U5.21 59.58,69.58 59.31,69.85 | 61.09,58.93 62.23,58.93 U5.59 62.23,57.4 | v101,65 101.47,65.47 101.47,66.21 101.71,66.44 U6.8 101.71,69.96 101.73,69.98 | U6.21 96.46,68.89 96.46,66.77 97,66.23 v97,65 | 99.06,57.28 U6.59 99.06,58.8 | 92.7,24.8 92.71,24.81 U7.59 92.71,26.67 | v91,19 91,17.4 90.49,16.89 90.29,16.89 89.92,16.52 89.92,15.99 90.06,15.86 U7.8 90.06,13.86 90,13.8 | v94,19 95.11,17.89 95.11,17.61 95.36,17.37 U7.21 95.36,14.24 95.5,14.1 | v58,18 58.28,17.71 58.28,17.61 58.53,17.37 U8.21 58.53,13.97 58.6,13.9 | v54,18 54,17.7 53,16.7 53,15.7 53.23,15.47 U8.8 53.23,13.73 53.2,13.7 | U8.59 55.88,24.68 55.8,24.6 | C81.2 53.27,29.67
  Top 0.2: 92.71,26.67 92.71,27.3 v92.2,27.81 | 62.23,57.4 62.23,56.64
  Top 0.203: IC1.29 36.07,49.1 36.07,51.69 | IC1.48 41.08,56.75 40.56,57.27 40.56,58.81 40.64,58.89 40.64,59.69 | C28.2 34.93,46.69 35.86,46.69 | 54.4,11.1 54.14,11.36 53.03,11.36 51.06,13.33 51.06,13.85 51.3,14.09 52.33,14.09 52.69,13.73 53.23,13.73 | 61.09,58.93 61,59.02 v61,61 | C43.1 102.49,70.74 101.71,69.96 | 99.06,57.28 99.44,56.9
  Top 0.254: C24.1 29.5,54.14 30.75,54.14 31.03,53.87 31.03,53.75 31.69,53.09 IC1.19 v34.29,53.09 | 28.21,46.24 U4.5 23.51,46.24 | 20.07,41.02 U4.42 20.07,44.06 | 20.57,49.91 U4.18 20.57,54.31 C14.2 21.73,54.71 21.73,55.9 v21.84,56.01 | 17.24,44.74 U4.35 13.63,44.74 C15.2 12.7,44.07 12.7,43.18 13.97,41.91 13.97,38.1 | IC1.14 34.29,55.59 | 35.58,61.45 IC1.9 35.58,55.59 34.29,55.59 | IC1.29 36.08,46.92 | J1.S6 J1.S2 4.45,48.77 J1.S4 | J1.S6 | J1.S5 J1.S1 4.34,55.37 J1.S3 4.6,55.12 3.3V.- L.- | J1.S5 | U2.2 19.68,9.14 v19.05,8.51 | 99.06,58.8 98.93,58.93 97.92,58.93 97.92,60.92 v98,61 | C17.2 C16.2 38.29,61.1 38.3,61.1 38.58,60.82 IC1.3 | C30.2 17.78,65.58 v17.78,65.28 | RESET.1 13.6,80 12.7,80 | 12.7,80 S6.P1 | C29.2 J3.GND | Q3.2 49.53,40.64 44.45,40.64 v44.45,41.91 C33.1 | ID.3 v22.86,30.23 21.84,29.21 v21.59,29.21 | J1.5 J1.S4 | U1.2 8.89,52.07 8.89,49.53 | 8.89,49.53 8.23,48.87 J1.S4 | U3.2 36.83,14.86 C7.1 v37.72,12.19 | C2.1 25.4,8.38 D1.A C1.1 31.24,3.43 C5.1 C6.1 v35.56,1.27 | C12.2 C13.2 20.32,37.47 v19.05,37.47 14.61,37.47 13.97,38.1 | ID.3 ID.2 ID.1 16.53,26.18 R2.1 14.61,25.53 v14.61,27.69 13.97,27.69 13.97,38.1 | ID.3 ID.4 ID.5 ID.6 ID.7 | C11.1 37.59,20.27 37.15,19.83 37.15,18.39 36.96,18.2 35.69,18.2 35.56,18.07 35.51,18.07 35.25,18.33 35.25,22.1 35.56,22.41 ID.8 | 28.45,46.48 28.4,46.48 C10.2 29.21,45.47 29.21,39.37 C9.1 | 29.34,46.99 R11.1 29.64,48.26 C25.1 29.64,50.55 29.38,50.8 C23.2 28.7,51.31 C24.1 | 29.34,46.99 C8.2 | C24.1 28.7,55.12 C22.2 C19.2 | C18.2 33.15,62.61 | 35.6,61.42 35.6,61.72 R10.1 34.67,62.61 33.15,62.61 | v34.29,53.09 | IC1.16 34.29,54.59 | 34.29,54.59 v34.29,53.09 | 34.29,54.59 34.29,55.59
  Top 0.254: 36.07,51.69 36.07,53.09 v34.29,53.09 | X2.2 39.5,44.8 | 39.5,44.8 C27.2 41.53,45.26 v41.53,46.23 | C26.1 32.56,46.99 | 32.56,46.99 32.56,44.45 | 32.56,44.45 32.56,41.91 39.5,41.91 39.5,44.8 | 29.34,46.99 32.56,46.99 | 32.56,44.45 31.75,44.45 v31.75,44.08 | v10.16,49.53 8.89,49.53 | J1.S5 J1.S6 | v31.37,62.61 33.15,62.61 | v41.91,69.85 40.69,69.85 J2.14 J2.13 J2.12 40.69,82.26 J2.11 | J2.11 27.46,71.12 29.54,71.12 | 29.54,71.12 J2.10 | J2.6 36.59,71.12 29.54,71.12 | J2.11 24.13,82.26 24.13,82.65 14.38,82.65 14.38,82.55 12.7,82.55 12.7,80 | v81.28,10.16 81.92,10.79 90.3,10.79 91.11,11.6 C70.2 | 62.23,56.64 v62.99,55.88 | 99.44,56.9 v99.44,56.13 | v55.24,28.57 55.88,27.94 55.88,26.38 | R27.2 38.73,20.32 | 46.61,12.7 C78.1 v44.07,13.08 | J1.S4 4.45,40.09 JP1.GND | R18.2 46.56,66.09 v46.48,66.17 45.09,67.56 45.09,68.66 45.47,69.04 C34.1 | R26.2 72.39,20.32 v73.66,19.05 | R25.2 77.04,23.29 v76.2,24.13 | v63.12,12.83 63.12,13.08 C73.1 73.66,13.08 C65.1 | C75.1 45.72,27.56 45.72,33.02 C89.- 48.26,33.02 49.53,31.75 C93.1 51.69,30.1 | C85.- 60.45,33.02 C83.1 62.23,27.94 62.23,27.56 C69.1 | C81.2 53.21,31.24 | 53.21,31.24 C87.1 | C91.1 51.69,30.1 | 53.21,31.24 51.69,31.24 51.69,30.1 | 92.71,24.81 92.71,23.29 v93,23 | 55.8,24.6 55.8,23.2 v56,23 | C52.1 57.66,50.83 C58.- | C40.2 66.82,72.47 67.02,72.67 72.67,72.67 v73.66,73.66 | R6.1 5.46,2.54 S7.P1 | v41.91,59.69 40.64,59.69
  Top 0.305: 28.21,46.24 28.45,46.48 28.4,46.53 C8.2 | C13.2 20.03,39.2 19.98,39.2 19.69,39.5 19.68,39.5 19.68,40.64 20.07,41.02 | 20.57,49.91 19.94,49.28 | 20.07,44.06 20.07,44.07 | 17.24,44.74 17.27,44.7 | 23.51,46.24 23.5,46.23 | 35.6,61.42 C17.2 | 36.08,46.92 35.86,46.69 X2.4 | C71.2 54.4,11.14 54.4,11.1 | R5.1 19.68,11.3 U2.2 | v61.72,52.07 62.23,52.58 C56.1 64.77,52.58 C50.2 C60.1 66.42,52.07 68.58,52.07 | TP2.P$1 40.64,6.35 v38.1,3.81 35.94,3.81 C6.1 | v38.1,1.27 v35.56,1.27 | C42.1 53.47,56.13 C52.1 | C62.1 68.58,52.07 | 68.58,52.07 68.58,50.8 C54.- 71.47,50.8 71.47,55.72 71.12,55.72 C44.1 | C46.1 74.04,70.74 v74.04,71.12 | v49.15,70.74 C38.1 | C45.1 90.17,56.13 C53.1 94.46,56.13 C59.- | C57.1 101.6,52.58 C51.2 C61.1 103.25,52.07 105.41,52.07 | C63.1 105.41,52.07 | 105.41,52.07 105.41,50.8 C55.- 107.95,50.8 C39.1 | C43.1 111,70.74 v111,70.23 | R21.2 v116.84,63.5 | C48.1 88.01,70.74 v88.01,70.99 82.55,70.99 C35.1 | CN2.1 83.82,53.34 81.28,53.34 81.28,60.2 82.17,60.2 82.17,61.34 83.39,61.34 R20.2 81.28,63.5 v81.28,64.77 | R19.2 77.9,60.96 v78.74,60.96 | C86.1 90.17,31.24 C80.2 C90.1 88.52,31.75 | 88.52,31.75 v88.9,31.75 | 88.52,31.75 86.36,31.75 | 86.36,31.75 C92.1 | C88.- 83.82,33.02 | 83.82,33.02 86.36,33.02 86.36,31.75 | C72.1 83.82,33.02 | C68.1 80.64,13.08 v80.64,13.46 | C64.1 110.49,13.08 C74.1 102.87,13.08 v102.87,11.43 | C84.- 97.28,33.02 C82.1 101.6,27.94 C76.1 | R24.2 111.76,20.32 | 111.76,20.32 111.76,30.48 107.95,30.48 CN5.1 | 111.76,20.32 115.57,20.32 115.57,3.81 116,3.81 S5.P1 | C41.2 100.97,73.23 v100.97,73.28 | 57.24,19 58,18.24 v58,18 | 57,19.24 57.24,19 | 57.24,19 v58,19 | 56,20.24 57,19.24 | 57,19.24 v57,18
  Top 0.305: 56,20.24 v56,18 | v54,18 54.83,18.83 54.83,19.31 U8.EPAD9 | U8.EPAD9 54.52,19 v54,19 | U8.EPAD9 55.52,20 v54,20 | U8.EPAD9 54.64,20.36 v54,21 | U8.EPAD9 56,20.24
  Top 0.406: R4.1 15.75,1.27 11.94,1.27 R6.1 v11.94,7.62 | C2.1 22.1,7.11 v21.59,7.62 | v21.59,8.51 v21.59,7.62 | v21.59,6.73 v21.59,7.62 | v21.59,7.62 v20.32,7.62 | 19.94,8.51 v20.32,8.51 | U2.9 19.43,7.62 v20.32,6.73 | v25.4,11.43 D1.A | C7.1 39.37,13.97 39.37,16.51 38.73,17.14 38.73,20.32 38.73,21.59 C11.1 | v58,23 v57,23 | U8.EPAD9 57.52,22 v58,22 | U8.EPAD9 56.52,21 v58,21 | U8.EPAD9 57.64,20.36 v58,20
  Top 0.508: C21.2 v41.91,59.69
  Top 0.813: C20.2 v31.37,62.61
  Route2 0.203: 23.77,29.24 29.5,29.24 31.18,27.56 34.33,27.56 45.76,16.13 52.83,16.13 | 22.73,28.07 29.59,28.07 30.86,26.8 34.01,26.8 45.94,14.86 54.61,14.86
  Route2 0.254: v41.91,69.85 42.8,70.74 49.4,70.74 | 23.77,29.24 22.86,30.15 v22.86,30.23 | 22.73,28.07 v21.59,29.21 17.78,33.02 17.78,45.72 | v41.91,69.85 42.5,69.26 66.31,69.26 67.14,68.43 98.18,68.43 98.71,68.96 103.5,68.96 | 16.51,48.26 16.51,50.32 17.4,51.21 17.4,55.02 20.23,57.85 20.23,58.48 22.38,60.64 22.38,63.71 28.52,69.85 v41.91,69.85
  Route2 0.305: 49.4,70.74 v49.15,70.74
  Bottom 0.203: v88.9,31.75 92.2,28.45 v92.2,27.81
  Bottom 0.254: v17.78,65.28 15.37,62.87 J3.GND | J3.GND 12.06,62.87 9.27,60.07 J3.SHIELD0 | J3.SHIELD1 4.58,80 S6.P1 | v21.84,56.01 21,55.16 18.51,55.16 17.96,54.61 16.51,54.61 16.51,53.34 15.24,53.34 | v34.29,53.09 34.29,40.64 30.48,40.64 30.48,36.83 | 30.48,36.83 30.48,35.56 33.02,35.56 SWD.3 SWD.5 | v14.61,27.69 14.61,36.83 | 14.61,36.83 19.05,36.83 | 19.05,36.83 22.13,36.83 22.13,37.43 23.59,37.43 | 23.59,37.43 23.59,36.83 30.48,36.83 | v31.75,44.08 24.13,44.08 v24.13,41.91 24.13,37.43 23.59,37.43 | v19.05,37.47 19.05,36.83 | 14.61,36.83 14.61,41.94 11.43,41.94 11.43,49.53 | v10.16,49.53 11.43,49.53 | 11.43,49.53 12.7,49.53 12.7,53.34 15.24,53.34 | v31.37,62.61 31.37,59.69 15.24,59.69 | 15.24,59.69 J3.GND | 15.24,59.69 15.24,53.34 | J3.SHIELD0 5.08,55.12 5.08,39.37 | J3.SHIELD1 J3.SHIELD0 | J3.SHIELD1 10.92,73.66 v15.24,73.66 | v46.48,66.17 49.53,63.12 49.53,53.34 | 49.53,53.34 47.03,53.34 CN1.1 | C58.- 57.63,51.59 55.88,53.34 49.53,53.34 | v73.66,19.05 69.85,19.05 | 69.85,19.05 68.58,19.05 68.58,30.48 | 68.58,30.48 71.08,30.48 CN6.1 | 68.58,30.48 60.96,30.48 60.48,30.96 C85.- 60.48,34.29 | v76.2,24.13 80.64,24.13 | C84.- 97.31,35.56 83.03,35.56 83.03,34.29 | C89.- 46.2,34.29 60,34.29 | 83.03,34.29 60.48,34.29 | 60,34.29 60.48,34.29 | v38.1,3.81 43.18,3.81 43.18,12.7 | 43.18,12.7 43.18,30.48 46.2,30.48 C89.- | C88.- 83.03,34.29 | 60,34.29 S3.P1 60,50.8 60.96,50.8 | v81.28,10.16 80.64,10.16 v80.64,13.46 | v63.12,12.83 69.85,12.83 69.85,19.05 | v44.07,13.08 44.07,12.7 43.18,12.7 | v61.72,52.07 62.99,53.34 v62.99,55.88 | 34.42,8.89 v34.29,8.89 | v44.45,41.91 46.2,40.16 C89.-
  Bottom 0.305: v34.29,8.89 38.1,5.08 | 38.1,5.08 v38.1,3.81 | C58.- 60.96,50.8 61.72,50.8 v61.72,52.07 | v73.66,73.66 74.04,73.28 v74.04,71.12 74.93,71.12 74.93,58.42 | 74.93,58.42 74.93,53.34 71.91,53.34 C54.- 71.91,49.53 83.82,49.53 | 49.53,63.12 49.53,70.74 v49.15,70.74 | 94.46,49.53 C59.- 94.46,52.07 88.01,52.07 v88.01,70.99 | 83.82,49.53 94.46,49.53 | 94.46,49.53 108.74,49.53 | 108.74,49.53 C55.- 111,50.8 v111,70.23 111,80 S4.P1 | CN2.1 83.82,53.34 | 83.82,53.34 83.82,49.53 | 108.74,49.53 116.84,49.53 v116.84,63.5 | v81.28,64.77 82.55,64.77 82.55,53.34 83.82,53.34 | v78.74,60.96 78.74,58.42 74.93,58.42 | v80.64,13.46 80.64,24.13 80.64,33.02 C88.- | v102.87,11.43 102.87,17.28 103.37,17.28 103.37,18.79 102.87,18.79 102.87,29.21 | C84.- 97.31,29.21 102.87,29.21 | CN5.1 107.95,29.21 102.87,29.21 | v37.72,12.19 38.1,11.81 38.1,5.08 | v100.97,73.28 100.97,72.72 100.41,72.16 100.41,71.2 98,68.79 v98,66
  Bottom 0.406: X1.2 16.51,13.97 16.51,8.89 | 16.51,8.89 v16.51,8.51 19.43,11.43 v25.4,11.43 | v11.94,7.62 R8.1 16.51,8.89
  Bottom 0.508: v41.91,59.69 44.45,57.15 44.45,54.61 45.68,53.38 CN1.1 | X1.2 X1.1 | X1.1 7.62,34.13 JP1.GNDBREAK 8.16,36.29 5.08,39.37 JP1.GND | X1.1 14.35,27.94 v14.61,27.69
  other vias: 98,65 99,65 100,65 101,64 100,64 99,64 98,64 98,63 99,63 100,63 101,63 101,62 100,62 99,62 98,62 99,61 100,61 101,61 100,66 99,66 97,64 97,63 97,62 97,61 62,65 63,65 64,64 63,64 62,64 61,64 61,63 62,63 63,63 64,63 64,62 63,62 62,62 61,62 62,61 63,61 64,61 91,22 92,22 93,22 94,22 94,21 93,21 92,21 91,21 91,20 92,20 93,20 94,20 93,19 92,19 94,23 92,23 91,23 54,23 55,23 57,22 56,22 55,22 55,21 56,21 57,21 57,20 56,20 55,20 55,19 56,19 57,19 55,18 17.78,7.62 17.78,6.73 19.05,6.73 17.78,8.51 16.51,7.62 16.51,6.73
  pour Bottom (isolate 0.254, rank 6, no thermals): 0,0 120,0 120,84 0,84
  pour Top (isolate 0.254, rank 6): 0,0 0,84 120,84 120,0
  pour Route2 (isolate 0.254, rank 6): 0,0 120,0 120,84 0,84
LINKLED  (via drill 0.35)
  Top 0.254: IC1.25 33.46,49.09 v33.4,49.15
  Top 0.305: v27.69,49.91 27.69,50.32 26.11,51.89 26.11,56.69 22.61,60.2 v12.7,60.2
  Route2 0.254: 28.39,49.15 v33.4,49.15
  Route2 0.305: v27.69,49.91 27.95,49.65 27.95,49.6 28.39,49.15 | 5.07,64.08 8.82,64.08 v12.7,60.2
  Route2 0.406: J3.Y- 4.24,63.25 5.07,64.08
N$1  (via drill 0.35)
  Top 0.152: U8.64 53.23,24.11 v53.34,24
  Top 0.254: v50.8,31.75 TP14.P$1
  Route2 0.254: v53.34,24 53.21,24.13 50.8,24.13 49.53,25.4 49.53,30.48 v50.8,31.75
N$2
  Top 0.254: U4.1 27.71,41.09 Q2.P$2 27.94,39.84 27.8,39.69 C9.2
N$3
  Top 0.305: C3.1 R5.2
N$4
  Top 0.254: U4.2 26.38,44.74 27.12,43.99 Q2.P$1 27.48,44.46 C10.1
N$5
  Top 0.254: RX.+ 13.84,56.64 15.9,58.7 RN1.1
N$6
  Top 0.254: TX.+ 16.4,57.8 RN1.2
N$7
  Top 0.305: R7.1 R8.2 15,9.4 15.88,10.28 U2.4
N$8
  Top 0.305: U2.6 18.41,3.68 R4.2 18.2,2.54 19.02,1.71 23.56,1.71 R3.1
N$9
  Top 0.305: U2.5 16.52,4.96 14.1,2.54 R6.2
N$10
  Top 0.254: RN1.3 16.75,57 16.04,56.3 16.04,56.17 15.75,55.88 12.06,55.88 11.3,56.64 L.+
N$11  (via drill 0.35)
  Top 0.254: 8.1,57.12 8.36,57.38 11.66,57.38 v12.7,58.42 | RN1.4 16.92,56.1 v16.86,56.16
  Top 0.305: 3.3V.+ 8.1,57.12
  Route2 0.254: v12.7,58.42 14.61,58.42 v16.86,56.16
N$12
  Top 0.305: U2.3 18.41,11.18 17.72,11.87 16.73,11.87 16.38,12.23 C3.2
N$13
  Top 0.203: X2.3 37.72,46.26 37.72,46.05 37.13,45.46 37.13,44.13 37.72,43.54 R12.1
  Top 0.254: C27.1 39.03,46.65 X2.3 37.08,47.67 IC1.31
N$15
  Top 0.305: U2.7 19.68,2.67 C4.1
N$17  (via drill 0.35)
  Top 0.305: v24.13,3.81 22.86,2.54 C4.2 | 21.34,11.43 20.95,11.05 U2.1 21.48,10.28 v22.35,9.4
  Top 0.813: 21.34,11.43 22.61,11.43 24.76,13.58 D1.C 25.45,13.53 L1.P$1
  Route2 0.305: v24.13,3.81 24.13,7.62 v22.35,9.4
N$18
  Top 0.305: RN4.8 72.7,76.71 BUSY1.+
N$19  (via drill 0.35)
  Top 0.254: C29.1 20.78,64.31 v20.32,64.77
  Top 0.305: v20.32,64.77 R13.1
  Route2 0.305: J3.P4 17.14,67.94 v20.32,64.77
N$20
  Top 0.406: Q1.1 15.99,22.62 R2.2 R1.1
N$21
  Top 0.254: J3.P5 17.14,66.67 18.24,67.77 C30.1
  Top 0.305: RN3.3 RN3.4 18.2,74.51 17.78,74.93 13.15,74.93 10.97,72.75 10.97,67.77 12.06,66.67 J3.P5
N$22
  Top 0.406: R14.1 21.08,77.47 19.56,77.47 17.65,75.56 12.97,75.56 10.24,72.82 10.24,69.93 1.4,61.09 J3.Y+
N$23
  Top 0.406: R15.1 19.95,79.25 17.66,76.96 9.98,76.96 9.96,76.98 6.62,76.98 3.56,73.91 J3.G+
N$24
  Top 0.254: IC1.23 31.68,51.09 31.17,50.57 31.17,49.21 30.86,48.9 R11.2
N$30
  Top 0.305: FLAG1.+ 77.07,74.57 RN4.7
N$32
  Top 0.305: C36.2 61.04,53.77 61.04,51.79 62.2,50.63 D6.3
N$33
  Top 0.152: 61.43,57.4 U5.57
  Top 0.2: 61.34,56.77 61.43,56.86 61.43,57.4
  Top 0.254: 61.34,56.77 61.11,56.54 61.11,56.47 60.96,56.32 C36.1
N$36  (via drill 0.3)
  Top 0.254: BUSY2.+ 109.22,77.98 v109.22,78.74 | RN4.6 77.87,77.07 v77.47,77.47
  Route15 0.254: v109.22,78.74 105.41,82.55 81.28,82.55 77.47,78.74 v77.47,77.47
N$37  (via drill 0.3)
  Top 0.254: FLAG2.+ 109.6,80.52 v110.49,81.41 | v78.74,77.47 78.74,73.27 RN4.5
  Route2 0.254: v110.49,81.41 109.09,82.8 81.53,82.8 78.74,80.01 v78.74,77.47
N$38
  Top 0.254: IC1.20 31.61,52.59 30.86,53.34 C24.2
N$39
  Top 0.152: U5.16 61.63,70.01
  Top 0.203: 61.63,70.01 61.9,70.27 61.9,70.87
  Top 0.305: FLAG1.- 69.85,80.77 69.85,77.7 67.51,75.36 63.7,75.36 61.9,73.56 61.9,70.87
N$40
  Top 0.254: IC1.10 35.08,59.79 R10.2
N$41
  Top 0.152: U5.15 62.03,69.78
  Top 0.254: 62.03,69.78 62.5,70.25 62.5,72.39
  Top 0.305: BUSY1.- 67.69,74.8 63.88,74.8 62.5,73.42 62.5,72.39
N$42  (via drill 0.3, 0.35)
  Top 0.152: U5.9 64.43,70.57 v64.26,70.74
  Top 0.305: v72.52,65.79 72.52,64.06 R19.1
  Top 1.016: U5.82 70.54,64.92 R19.1 70.54,62.08 U5.77
  Route15 0.305: v72.52,65.79 67.56,70.74 v64.26,70.74
N$43  (via drill 0.3)
  Top 0.152: v60.07,70.08 60.03,70.04 U5.20 | U5.20
  Top 0.254: R18.1 v51.33,63.5
  Top 1.016: U5.34 53.92,64.92 R18.1 53.92,62.08 U5.39
  Route15 0.254: v51.33,63.5 57.91,70.08 v60.07,70.08
N$44  (via drill 0.3)
  Top 0.152: U5.18 60.83,70.23 60.2,70.87
  Top 0.305: v52.07,72.39 49.53,72.39 48.26,71.12 R16.2 | 60.2,70.87 v60.2,72.39
  Route2 0.305: v60.2,72.39 v52.07,72.39
N$45
  Top 0.254: C34.2 47.96,68.12 R16.1 | 46.53,59.5 45.72,58.69 45.72,57.15 CN1.2
  Top 0.305: 46.53,59.5 47.62,60.6 47.62,67.18 R16.1
N$46  (via drill 0.3)
  Top 0.152: U5.EPAD4 58.18,62.12 v58.93,62.87
  Top 0.254: U5.42 56.84,60.99 U5.EPAD4 | U5.38 56.91,63.18 U5.EPAD4 | U5.EPAD4 58.96,61.13 U5.53
  Bottom 1.27: CN3.1 54.55,73.72 54.61,73.66 55.24,74.3 J4.1
  other vias: 57.91,62.1 58.93,61.47 56.9,61.47 56.9,62.87
  pour Bottom (isolate 0.254, rank 2, no thermals): 59.44,63.25 59.44,60.96 53.34,60.96 53.34,80.64 56.9,80.64 56.9,77.72 56.01,76.83 56.01,63.25
N$47  (via drill 0.3)
  Top 0.152: U5.EPAD3 57.95,64.9 v57.91,64.9
  Top 0.254: U5.37 57.47,63.82 58.42,64.77 58.31,64.88 | 58.31,64.88 U5.EPAD3 58.96,65.87 U5.22 | U5.33 57.18,66.01 58.31,64.88
  Top 1.27: CN3.2 56.53,76.22 J4.2
  other vias: 57.02,64.14 58.8,64.14 58.8,65.53 57.02,65.53
  pour Bottom (isolate 0.254, no thermals): 60.45,80.64 60.45,77.22 59.31,76.07 59.31,66.04 59.44,65.91 59.44,63.75 56.52,63.75 56.52,76.58 57.4,77.47 57.4,80.64
N$48  (via drill 0.3, 0.35)
  Top 0.152: U5.14 62.43,68.09 v62.23,67.89 | U6.12 100.06,69.71 v100.33,69.98
  Top 0.254: TP7.P$1 78.74,69.85 79.38,70.48 v79.88,70.48
  Route2 0.254: 97.79,68.96 98.81,69.98 v100.33,69.98 | 80.01,68.96 79.88,69.09 v79.88,70.48
  Route2 0.305: v64.26,73.41 64.26,72.01 67.31,68.96 80.01,68.96 97.79,68.96
  Route15 0.254: 62.23,69.85 v62.23,67.89
  Route15 0.305: v64.26,73.41 62.23,71.37 62.23,69.85
N$49
  Top 0.254: J1.2 5.35,52.72 5.59,52.96 7.53,52.96 U1.4
N$51  (via drill 0.3)
  Top 0.152: U5.EPAD8 66.55,64.83 v66.55,64.77
  Top 0.254: U5.EPAD8 67.56,63.82 U5.81 | U5.EPAD8 67.63,66.01 U5.85 | U5.EPAD8 65.5,65.88 U5.7
  Top 1.27: J4.3 60.33,81.28 49.55,81.28 CN3.3
  other vias: 65.41,65.53 67.56,65.53 65.41,64.14 67.56,64.14
  pour Bottom (isolate 0.254, rank 2, no thermals): 65.02,63.75 68.07,63.75 68.07,74.93 64.52,78.49 64.52,80.64 61.21,80.64 61.21,78.49 65.02,74.68
N$52  (via drill 0.3)
  Top 0.254: U5.65 65.5,61.05 v66.55,62.1 66.53,62.12 U5.EPAD7 | U5.EPAD7 67.62,60.99 U5.76 | U5.EPAD7 67.55,63.18 U5.80
  Bottom 1.27: CN3.4 48.32,82.55 66.04,82.55 66.67,81.92 J4.4
  other vias: 65.41,62.87 65.41,61.47 67.56,61.47 67.56,62.87
  pour Bottom (isolate 0.254, rank 2, no thermals): 65.02,63.25 65.02,60.96 71.63,60.96 71.63,77.6 68.58,80.64 65.02,80.64 65.02,78.61 68.71,74.93 68.71,63.25
N$53
  Top 0.305: C37.2 97.79,51.9 D7.3
N$54
  Top 0.152: U6.57 98.26,57.49 98.04,57.28
  Top 0.254: C37.1 98.04,55.63 98.04,57.28
N$56
  Top 0.254: BUSY3.+ 82.68,7.11 82.24,7.11 81.03,7.11 78.77,9.37 RN5.8
N$57
  Top 0.254: FLAG3.+ 77.87,9.25 RN5.7
N$58
  Top 0.152: U6.16 98.46,70.01 98.81,70.36
  Top 0.254: FLAG2.- 106.68,80.77 106.68,77.63 104.11,75.06 100.55,75.06 98.81,73.31 98.81,70.36
N$59
  Top 0.152: U6.15 98.86,69.9 99.31,70.36
  Top 0.254: 99.31,70.36 99.31,73.15 100.71,74.55 104.27,74.55 BUSY2.-
N$61  (via drill 0.3)
  Top 0.152: U6.9 101.26,70.57 v101.09,70.74
  Top 0.203: v108.84,65.79 108.79,65.73 R21.1
  Top 1.016: U6.82 107.37,64.92 R21.1 107.37,62.08 U6.77
  Route15 0.203: v101.09,70.74 102.36,70.74 103.5,69.6 105.03,69.6 v108.84,65.79
N$62  (via drill 0.3)
  Top 0.152: U6.20 96.86,70.7 v96.77,70.61
  Top 0.254: v89.53,65.66 89.33,65.46 R20.1
  Top 1.016: U6.34 90.75,64.92 R20.1 90.75,62.08 U6.39
  Route15 0.254: v96.77,70.61 94.49,70.61 v89.53,65.66
N$63
  Top 0.152: 97.66,69.47 U6.18
  Top 0.178: 97.66,69.47 97.66,70.25 97.55,70.36 97.55,70.63 97.43,70.76
  Top 0.254: 97.05,71.39 97.43,71.01 97.43,70.76
  Top 0.305: R17.2 85.6,69.85 93.98,69.85 95.53,71.39 97.05,71.39
N$64  (via drill 0.3)
  Top 0.152: U6.64 101.71,59.83 v101.6,59.94 | U7.63 90.46,23.91 v90.42,23.88
  Top 0.254: TP12.P$1 v88.9,34.29
  Route2 0.254: v88.9,34.29 90.42,34.29
  Route2 0.305: v90.42,23.88 90.42,34.29 90.42,35.81 101.6,46.99 v101.6,59.94
N$65  (via drill 0.3)  (1 unrouted)
  Top 0.178: U6.38 93.74,63.18 U6.EPAD4 | U6.42 93.67,60.99 U6.EPAD4 | U6.53 95.79,61.13 U6.EPAD4
  Bottom 1.27: CN4.1 83.88,73.66 91.44,73.66 92.08,74.3 J5.1
  other vias: 94.74,62.23 93.73,61.47 93.73,62.87 95.89,62.87 95.89,61.47
  pour Bottom (isolate 0.254, rank 3, no thermals): 96.27,63.25 92.84,63.25 92.84,73.91 93.73,74.8 93.73,80.01 90.42,80.01 90.42,75.69 90.17,75.44 90.17,60.96 96.27,60.96
N$66  (via drill 0.3)
  Top 0.152: U6.EPAD3 94.74,64.82 v94.74,64.77
  Top 0.178: U6.33 93.67,66.01 U6.EPAD3 | U6.37 93.74,63.82 U6.EPAD3 | U6.22 95.79,65.87 U6.EPAD3
  Top 1.27: J5.2 93.36,76.22 CN4.2
  other vias: 93.73,64.14 95.89,64.14 95.89,65.53 93.73,65.53
  pour Bottom (isolate 0.254, rank 3, no thermals): 96.27,63.75 93.34,63.75 93.34,68.71 93.34,73.66 94.23,74.55 94.23,80.01 97.28,80.01 97.41,79.88 97.41,74.42 96.14,73.15 96.14,66.04 96.27,66.04
N$67  (via drill 0.3)  (1 unrouted)
  Top 0.178: U6.85 104.46,66.01 U6.EPAD8 | U6.81 104.39,63.82 U6.EPAD8 | U6.7 102.33,65.88 U6.EPAD8
  Top 1.27: J5.3 97.16,81.28 90.17,81.28 87.61,78.72 CN4.3
  other vias: 103.38,64.77 102.36,65.53 102.36,64.14 104.39,64.14 104.39,65.53
  pour Bottom (isolate 0.254, rank 3, no thermals): 104.78,63.75 101.85,63.75 101.85,73.66 98.17,77.34 98.17,80.14 101.35,80.14 101.35,77.34 104.78,73.91
N$68  (via drill 0.3)  (1 unrouted)
  Top 0.178: U6.80 104.38,63.18 U6.EPAD7 103.42,62.02 | U6.76 104.45,60.99 103.42,62.02 | U6.65 102.33,60.93 103.42,62.02
  Bottom 1.27: CN4.4 85.15,82.55 101.6,82.55 103.5,80.64 J5.4
  other vias: 103.38,62.1 102.36,62.87 102.36,61.47 104.39,61.47 104.39,62.87
  pour Bottom (isolate 0.254, rank 3, no thermals): 101.85,60.96 108.33,60.96 108.33,76.33 104.65,80.01 101.85,80.01 101.85,77.47 105.28,74.04 105.16,74.04 105.16,63.25 101.85,63.25
N$69
  Top 0.254: C35.2 84.79,68.12 R17.1 85.09,61.34 82.55,58.8 82.55,57.15 CN2.2
N$70  (via drill 0.35)
  Top 0.254: BUSY4.+ 45.21,7.11 v44.45,6.35
  Top 0.305: RN5.6 77.07,4.68 v76.2,3.81
  Route2 0.305: v76.2,3.81 73.66,1.27 49.53,1.27 v44.45,6.35
N$71
  Top 0.152: 94.24,27.06 U7.56
  Top 0.254: D12.2 90.51,35.27 90.72,35.27 | 94.24,27.06 94.24,26.55
  Top 0.305: 94.24,26.55 94.24,27.21 94.81,27.77 94.81,31.21 90.75,35.27 90.72,35.27 | C77.1 90.68,35.48 D12.2
N$72
  Top 0.305: C66.2 93.98,30.86 91.65,33.19 D12.3
N$73
  Top 0.152: U7.57 93.51,26.42
  Top 0.254: 93.51,26.42 93.51,26.45
  Top 0.305: 93.51,26.45 93.64,26.58 93.64,27.72 93.98,28.07 C66.1
N$75  (via drill 0.35)
  Top 0.254: FLAG4.+ 45.21,3.3 v44.45,2.54
  Top 0.305: RN5.5 76.17,5.11 v76.2,5.08
  Route15 0.305: v76.2,5.08 72.39,1.27 45.72,1.27 v44.45,2.54
N$76  (via drill 0.3)
  Top 0.152: U7.EPAD7 88.39,21.64 v88.39,21.59
  Top 0.203: U7.80 87.39,20.64 U7.EPAD7 | U7.76 87.32,22.83 U7.EPAD7 | U7.65 89.44,22.69 U7.EPAD7
  Bottom 1.27: CN7.4 107,1.65 90.42,1.65 88.27,3.81 J6.4
  other vias: 87.38,22.35 87.38,20.95 89.41,20.95 89.41,22.35
  pour Bottom (no thermals): 89.92,20.57 89.92,22.73 83.69,22.73 83.69,7.87 87.88,3.68 89.53,3.68 89.92,4.06 89.92,6.22 86.61,9.53 86.61,20.57
N$77
  Top 0.152: U7.16 93.31,12.54 93.09,12.32
  Top 0.203: 93.09,12.32 93.09,11.02
  Top 0.305: FLAG3.- 84.96,2.92 84.96,5.71 88.85,9.6 91.67,9.6 93.09,11.02
N$78
  Top 0.152: U7.15 92.91,12.9 92.46,12.45
  Top 0.203: 92.46,12.45 92.46,11.18 91.44,10.16
  Top 0.305: BUSY3.- 88.39,10.16 91.44,10.16
N$80  (via drill 0.35)
  Top 0.152: U7.9 90.51,13.38 v90.68,13.21
  Top 0.305: R25.1 82.98,18.09 v82.93,18.03
  Top 1.016: U7.77 84.4,21.74 R25.1 84.4,18.9 U7.82
  Route15 0.254: v82.93,18.03 87.76,13.21 v90.68,13.21
N$81  (via drill 0.35)
  Top 0.152: U7.20 94.91,13.55 v95.12,13.34
  Top 0.254: R24.1 102.62,20.14 v102.62,18.03
  Top 1.016: U7.39 101.02,21.74 R24.1 101.02,18.9 U7.34
  Route15 0.254: v102.62,18.03 97.92,13.34 v95.12,13.34
N$82  (via drill 0.35)
  Top 0.15: U7.18 v94.11,13.34
  Top 0.254: R22.2 v106.55,14.48
  Route2 0.254: v106.55,14.48 106.05,14.99 95.74,14.99 94.39,13.64 94.39,13.62 v94.11,13.34
N$83  (via drill 0.3, 0.35)
  Top 0.152: U6.14 99.26,68 v99.31,67.94 | U7.12 91.71,13.99 v91.44,13.72
  Top 0.254: TP8.P$1 v115.57,39.37
  Route2 0.203: v99.31,67.94 99.62,67.94 99.92,68.25 105.04,68.25
  Route2 0.305: 105.04,68.25 108.68,64.6 109.65,64.6 115.57,58.67 v115.57,39.37 115.57,19.05 111.95,15.43 93.15,15.43 v91.44,13.72
N$84  (via drill 0.3)  (1 unrouted)
  Top 0.203: U7.38 98.03,20.64 U7.EPAD4 | U7.42 98.1,22.83 U7.EPAD4 | U7.53 95.98,22.69 U7.EPAD4
  Bottom 1.27: CN7.1 101.54,10.1 99.69,8.26 J6.1
  other vias: 97.03,21.59 96.01,20.95 96.01,22.35 98.04,22.35 98.04,20.95
  pour Bottom (no thermals): 95.5,20.57 95.5,22.86 101.98,22.86 101.98,3.68 98.68,3.68 98.17,4.19 98.17,5.84 98.93,6.6 98.93,20.57
N$85  (via drill 0.3)  (1 unrouted)
  Top 0.203: U7.22 95.98,17.95 96.8,18.77 | 96.8,18.77 U7.EPAD3 98.03,20 U7.37 | U7.33 97.76,17.81 96.8,18.77
  Top 1.27: CN7.2 98.41,7.6 J6.2
  other vias: 97.03,18.92 96.01,18.29 96.01,19.68 98.04,19.68 98.04,18.29
  pour Bottom (no thermals): 98.42,20.07 98.42,6.86 97.66,6.1 97.66,3.94 97.41,3.68 94.61,3.68 94.36,3.94 94.36,6.35 95.63,7.62 95.63,15.88 95.5,16 95.5,20.07
N$86  (via drill 0.3)  (1 unrouted)
  Top 0.203: U7.7 89.44,17.94 U7.EPAD8 | U7.EPAD8 87.31,17.81 U7.85 | U7.81 87.38,20 U7.EPAD8
  Top 1.27: J6.3 94.36,2.79 104.27,2.79 106.57,5.1 CN7.3
  other vias: 88.39,18.92 87.38,19.68 87.38,18.29 89.41,18.29 89.41,19.68
  pour Bottom (no thermals): 87,20.07 87,9.91 90.3,6.6 90.42,6.48 90.42,4.06 90.68,3.81 93.09,3.81 93.73,4.45 93.73,6.35 93.73,7.62 90.17,11.18 89.92,11.43 89.92,20.07
N$87  (via drill 0.3)  (1 unrouted)
  Top 0.203: U8.65 52.61,22.69 U8.EPAD7 | U8.76 50.49,22.83 U8.EPAD7 | U8.80 50.56,20.64 U8.EPAD7
  Bottom 1.27: J7.4 51.44,3.17 53.34,1.27 69.85,1.27 71.12,2.54 CN8.4
  other vias: 51.56,21.72 50.67,20.95 50.67,22.35 52.58,22.35 52.58,20.95
  pour Bottom (isolate 0.254, no thermals): 53.09,20.57 53.09,22.86 46.23,22.86 46.23,8 50.55,3.68 50.8,3.43 52.2,3.43 52.45,3.43 52.96,3.94 52.96,7.49 49.66,10.79 49.66,20.57
N$88
  Top 0.254: R22.1 110.19,16 C64.2
  Top 0.305: CN5.2 107.95,27.06 109.09,25.91 109.09,24.38 107.31,22.61 107.31,16.64 R22.1
N$89  (via drill 0.3)  (1 unrouted)
  Top 0.203: U8.81 50.55,20 U8.EPAD8 | U8.85 50.48,17.81 U8.EPAD8 | U8.7 52.61,17.94 U8.EPAD8
  Top 1.27: J7.3 57.78,2.54 64.77,2.54 67.33,5.1 CN8.3
  other vias: 51.56,19.05 50.67,18.29 50.67,19.56 52.58,19.56 52.58,18.29
  pour Bottom (isolate 0.254, no thermals): 53.09,20.07 50.16,20.07 50.16,10.79 53.47,7.49 53.47,3.94 53.85,3.56 56.13,3.56 56.9,4.32 56.9,7.87 53.09,11.68
N$90
  Top 0.152: U8.56 57.41,26.67
  Top 0.254: 53.66,35.56 D13.2 | 57.41,26.67 57.41,26.93 58.04,27.56
  Top 0.305: 58.04,27.56 58.04,31.18 53.66,35.56 | D13.2 53.66,36.64 C79.1
N$91
  Top 0.305: C67.2 57.15,30.65 D13.3
N$92
  Top 0.152: U8.57 56.68,26.33 56.9,26.54
  Top 0.254: 56.9,26.67 56.9,26.54
  Top 0.305: 56.9,26.67 56.9,28.19 C67.1
N$96
  Top 0.152: U8.16 56.48,14.26 56.64,14.1
  Top 0.254: FLAG4.- 47.88,1.78 49.53,3.43 49.53,6.35 51.05,7.87 54.33,7.87 56.64,10.18 56.64,14.1
N$97
  Top 0.152: U8.15 56.08,14.15 56.13,14.1
  Top 0.254: BUSY4.- 47.88,5.59 50.67,8.38 54.05,8.38 56.13,10.47 56.13,14.1
N$99  (via drill 0.35)
  Top 0.152: v53.85,12.7 53.68,12.87 U8.9
  Top 0.254: v45.97,18.03 46.15,18.21 R27.1
  Top 1.016: U8.77 47.57,21.74 R27.1 47.57,18.9 U8.82
  Route15 0.254: v53.85,12.7 51.31,12.7 v45.97,18.03
N$100  (via drill 0.35)
  Top 0.152: U8.20 58.08,13.12 v57.91,12.95
  Top 0.254: v65.79,17.95 65.61,18.13 R26.1
  Top 1.016: U8.39 64.19,21.74 R26.1 64.19,18.9 U8.34
  Route15 0.254: v57.91,12.95 62.91,17.95 v65.79,17.95
N$101  (via drill 0.35)
  Top 0.152: U8.18 57.28,14.01 v57.45,13.84
  Top 0.254: R23.2 70.48,13.84 v68.45,13.84
  Route2 0.254: v68.45,13.84 v57.45,13.84
N$103  (via drill 0.3)  (1 unrouted)
  Top 0.203: U8.38 61.2,20.64 U8.EPAD4 | U8.42 61.27,22.83 U8.EPAD4 | U8.53 59.15,22.69 U8.EPAD4
  Bottom 1.27: CN8.1 71.06,10.16 63.5,10.16 63.5,5.71 J7.1
  other vias: 60.2,21.72 59.05,20.95 59.05,22.35 61.21,22.35 61.21,20.95
  pour Bottom (isolate 0.254, no thermals): 58.67,22.86 58.67,20.57 62.36,20.57 62.36,7.24 61.34,6.22 61.34,4.06 61.85,3.56 64.52,3.56 65.28,4.32 65.28,22.86
N$104  (via drill 0.3)  (1 unrouted)
  Top 0.203: U8.33 61.27,17.81 U8.EPAD3 | U8.37 61.2,20 U8.EPAD3 | U8.22 59.15,17.95 U8.EPAD3
  Top 1.27: J7.2 61.59,7.62 71.12,7.62 CN8.2
  other vias: 60.2,19.05 59.18,18.29 59.18,19.68 61.21,19.68 61.21,18.29
  pour Bottom (isolate 0.254, no thermals): 61.72,20.07 58.67,20.07 58.67,10.41 58.67,7.87 57.4,6.6 57.4,3.94 57.78,3.56 60.2,3.56 60.71,4.06 60.71,6.35 61.72,7.37
N$107
  Top 0.254: C65.2 73.36,16 R23.1 71.12,17.98 70.6,18.5 70.6,18.66 70.6,19.05 70.6,22.14 72.39,23.93 72.39,26.67 CN6.2
N$108  (via drill 0.3)
  Top 0.152: U5.63 64.48,59.09 v64.39,59.18
  Top 0.254: Q3.3 52.07,44.28 53.17,43.18 TP10.P$1
  Top 0.305: v51.82,46.35 51.69,46.23 51.48,46.23 Q3.3